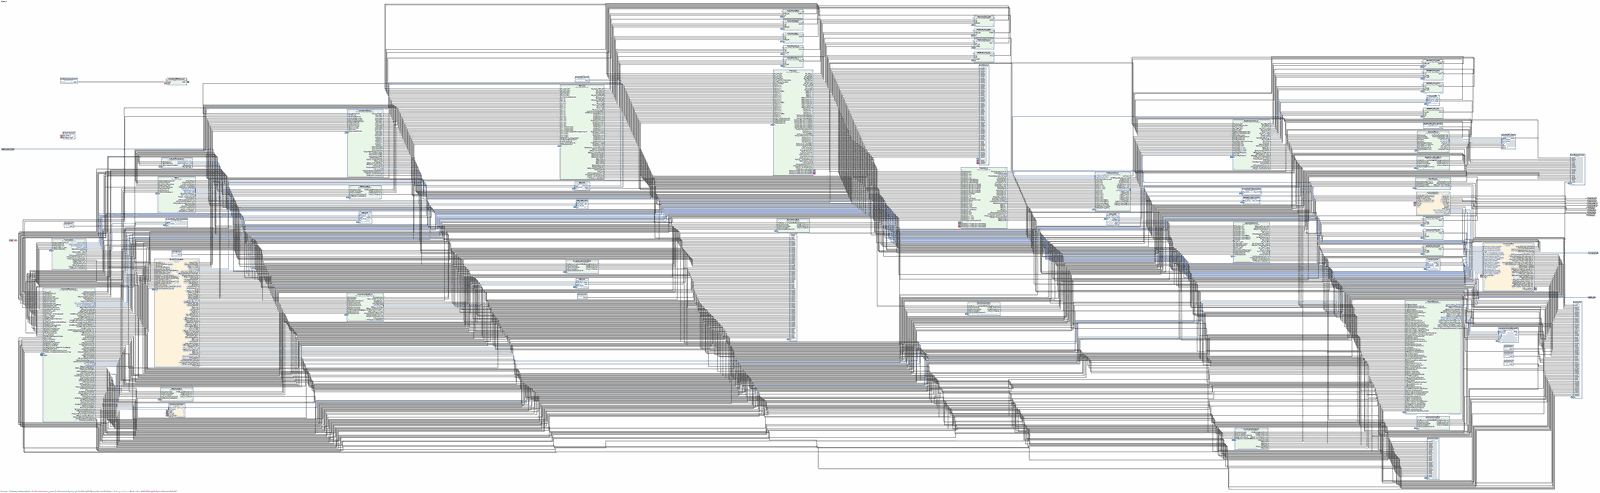
[diagram p0: block diagram of the top level, whole]
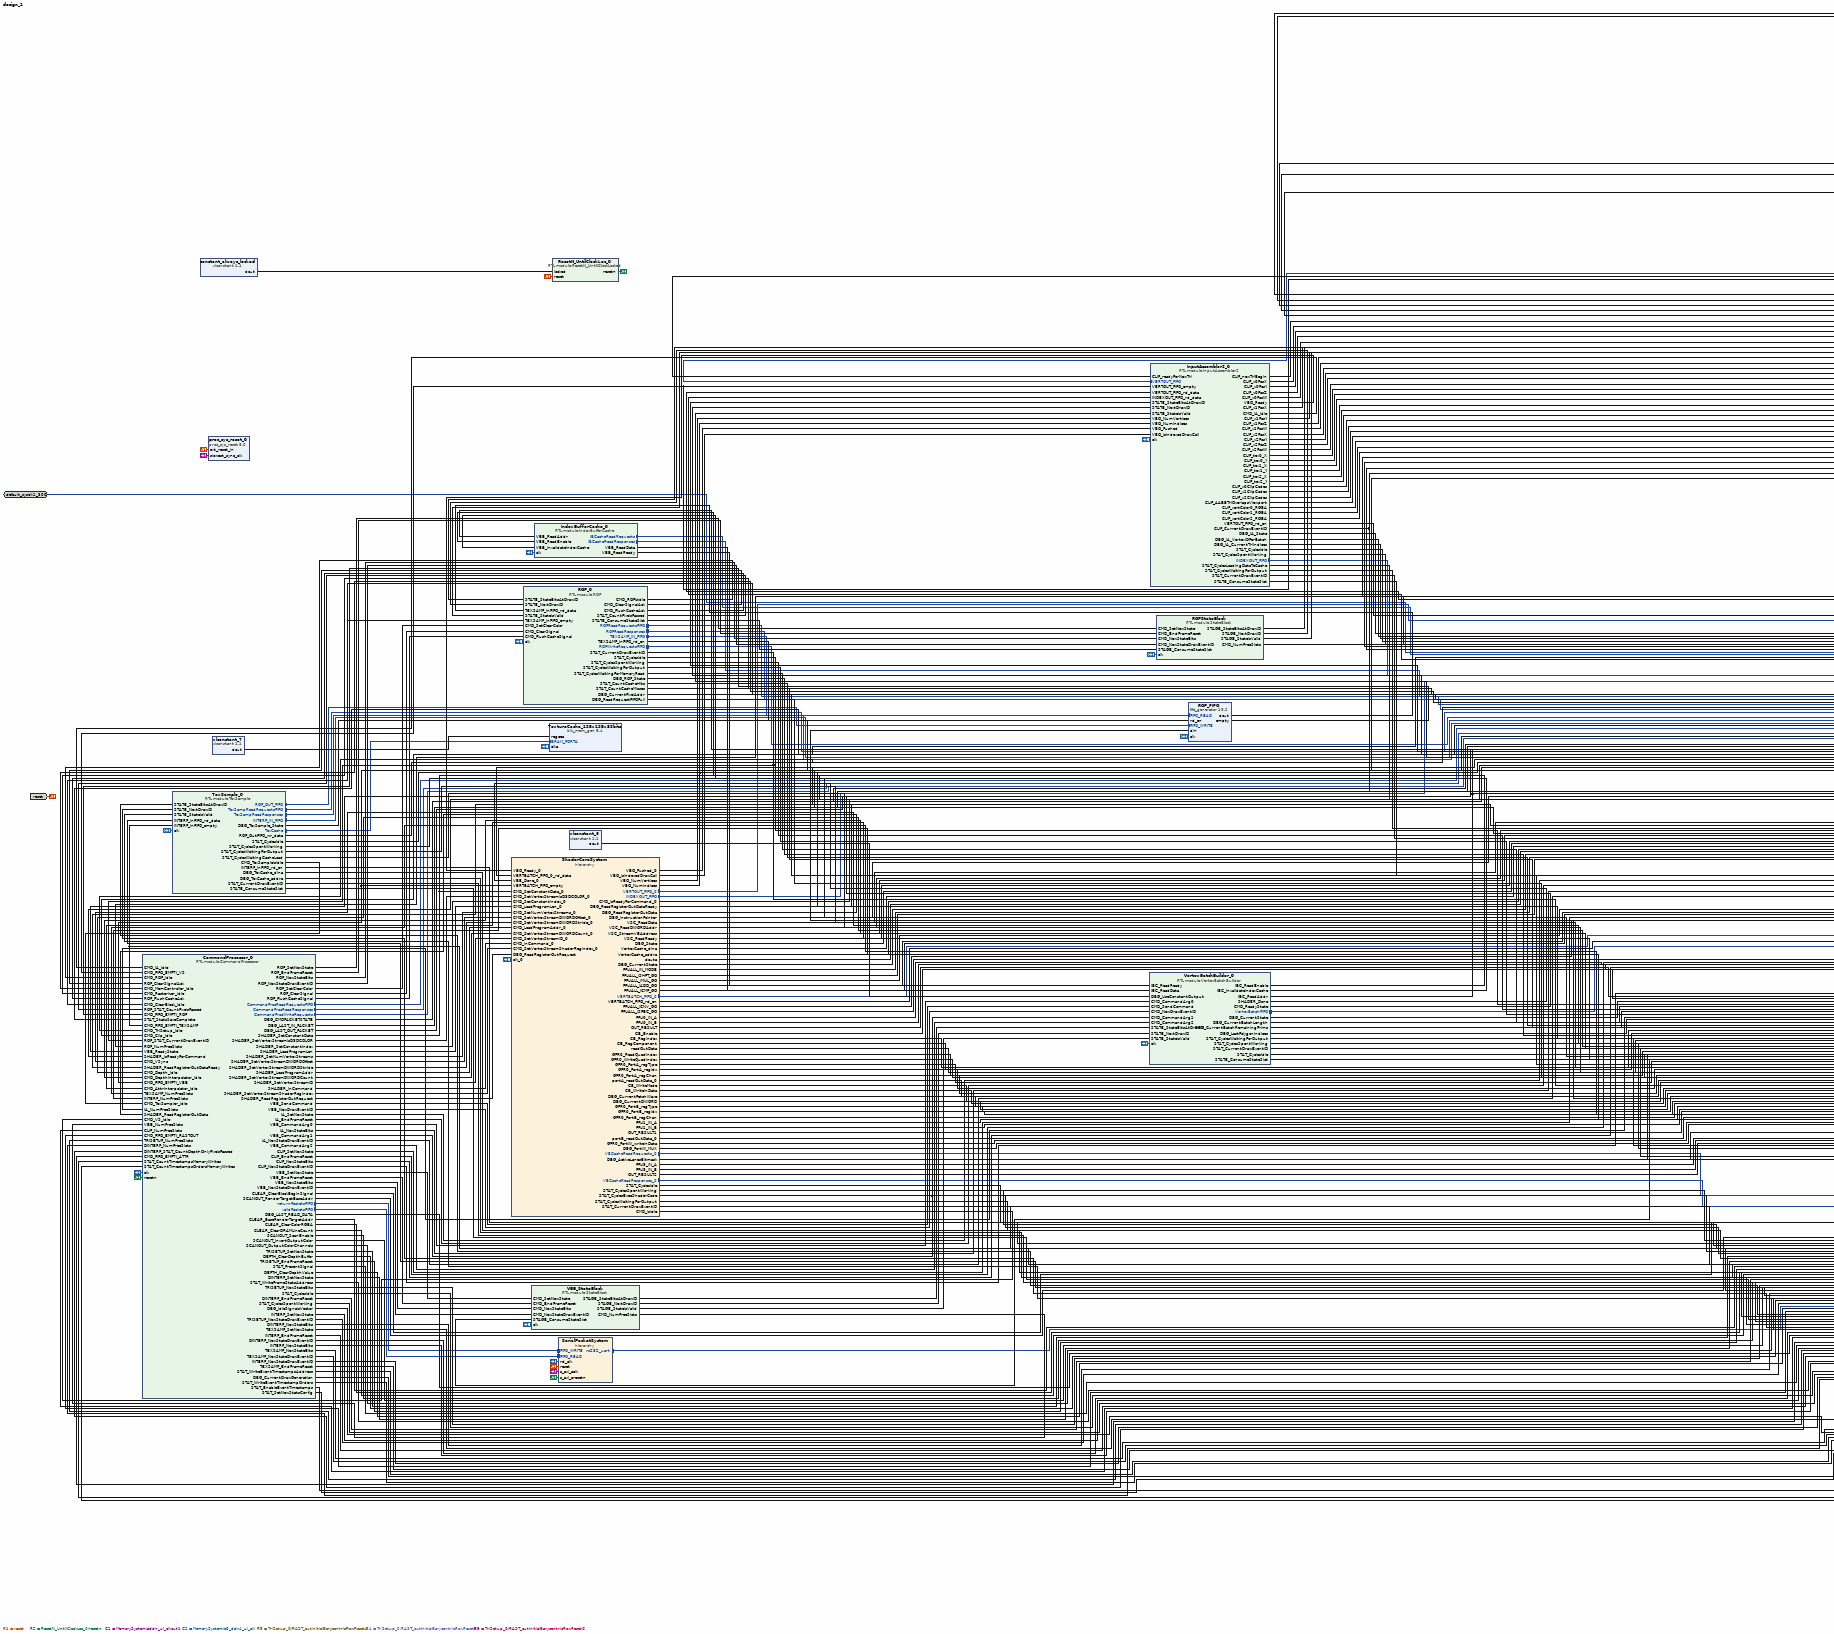
[diagram p1: block diagram of the top level, left part]
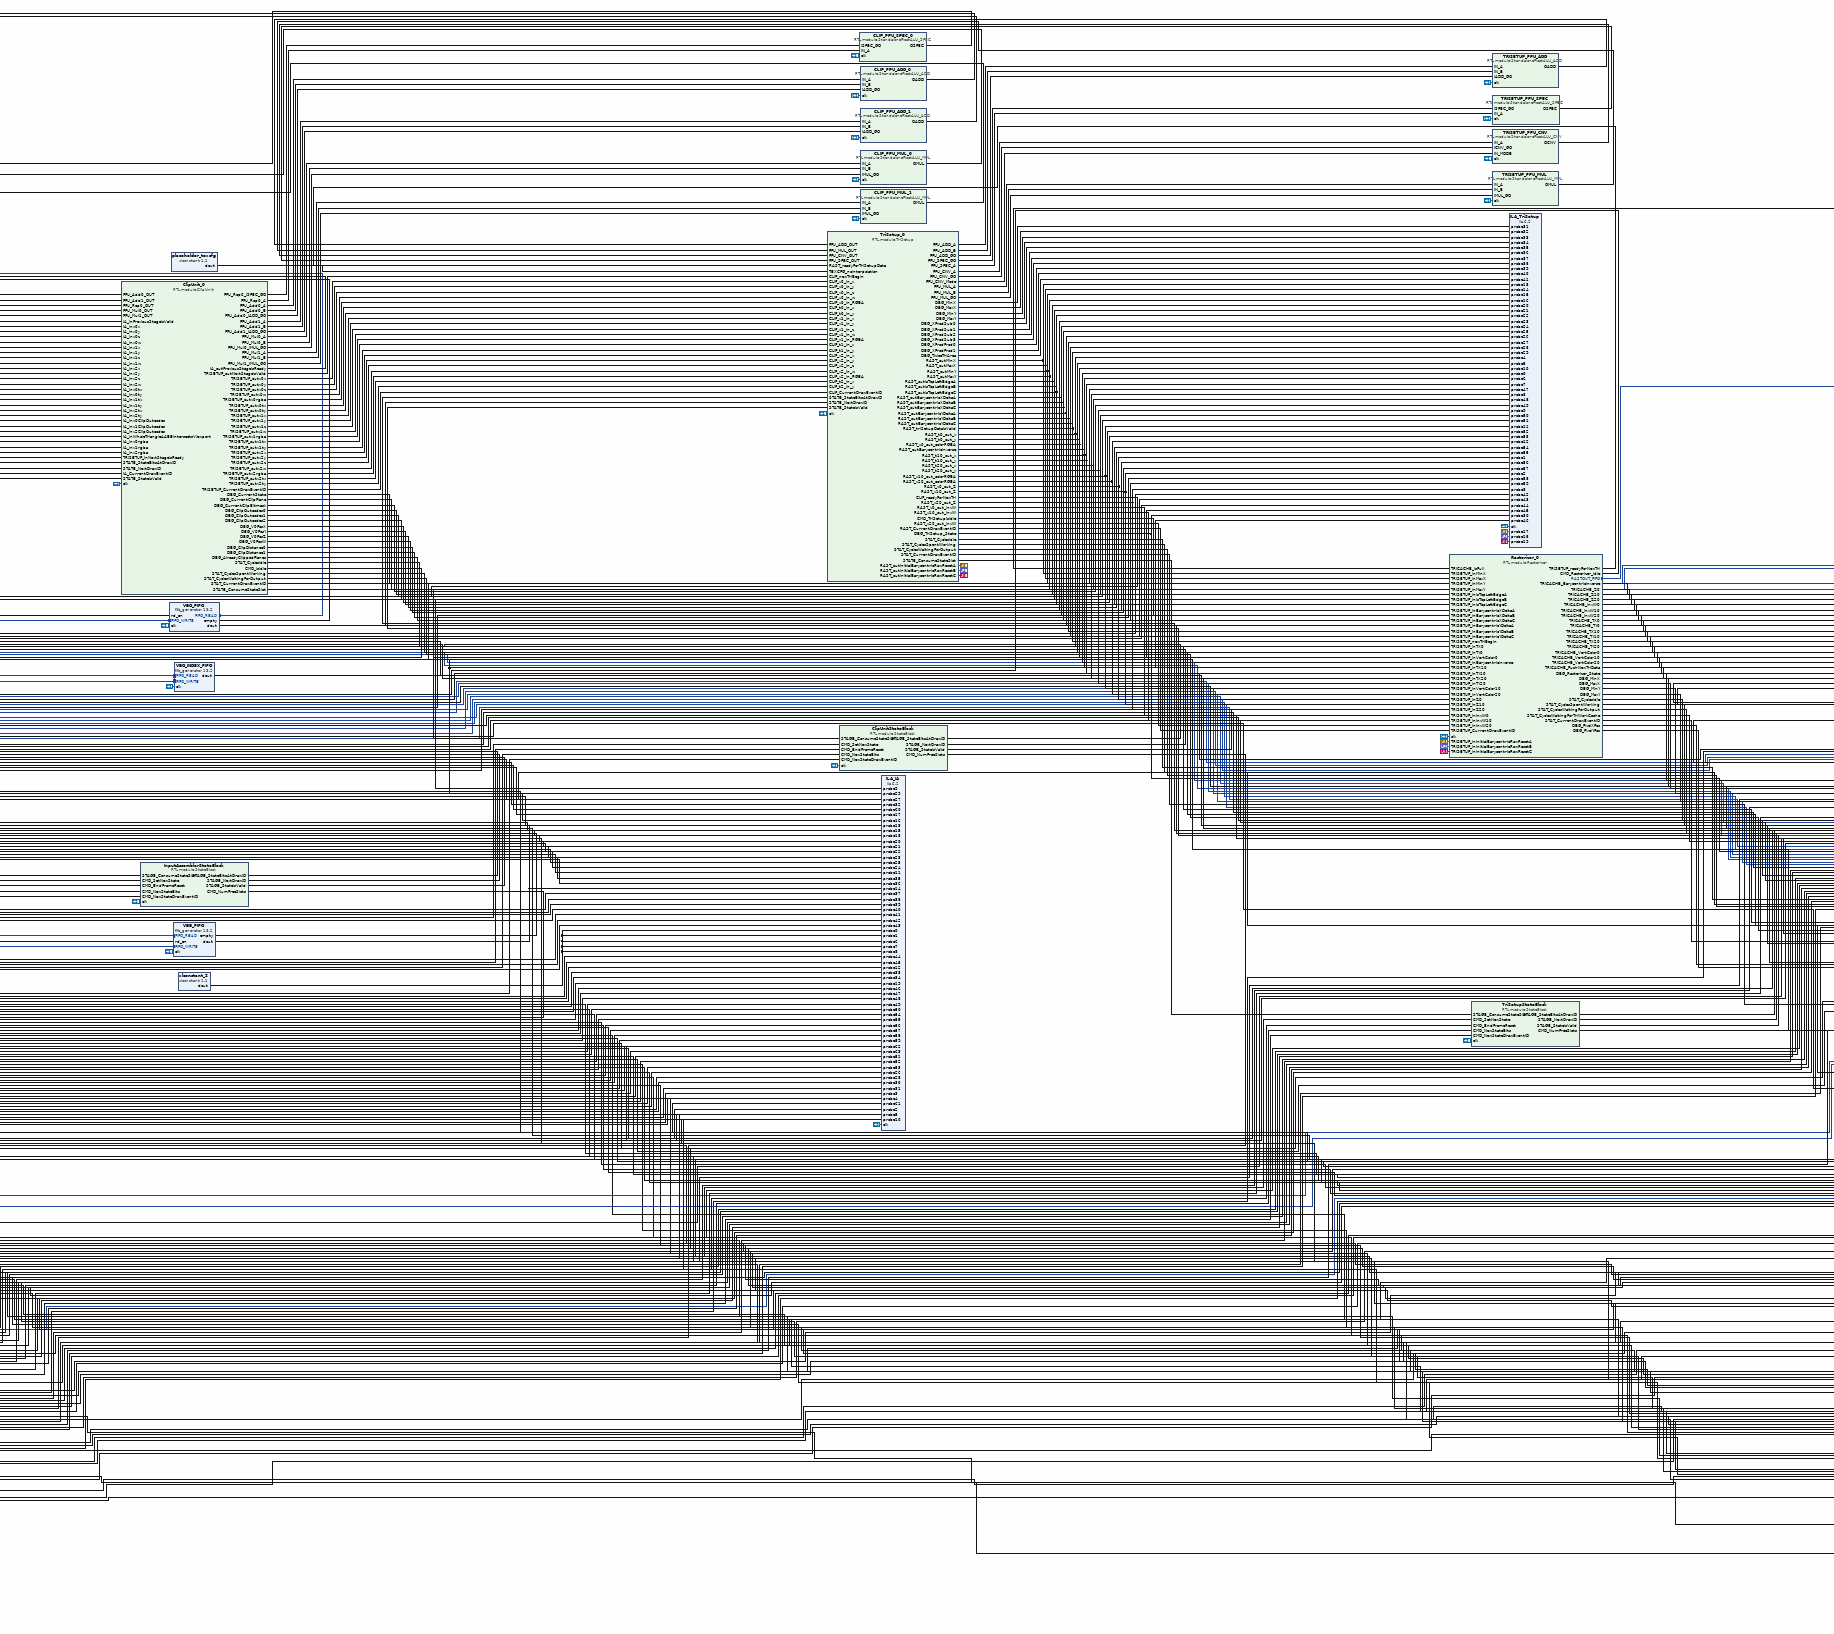
[diagram p2: block diagram of the top level, centre part]
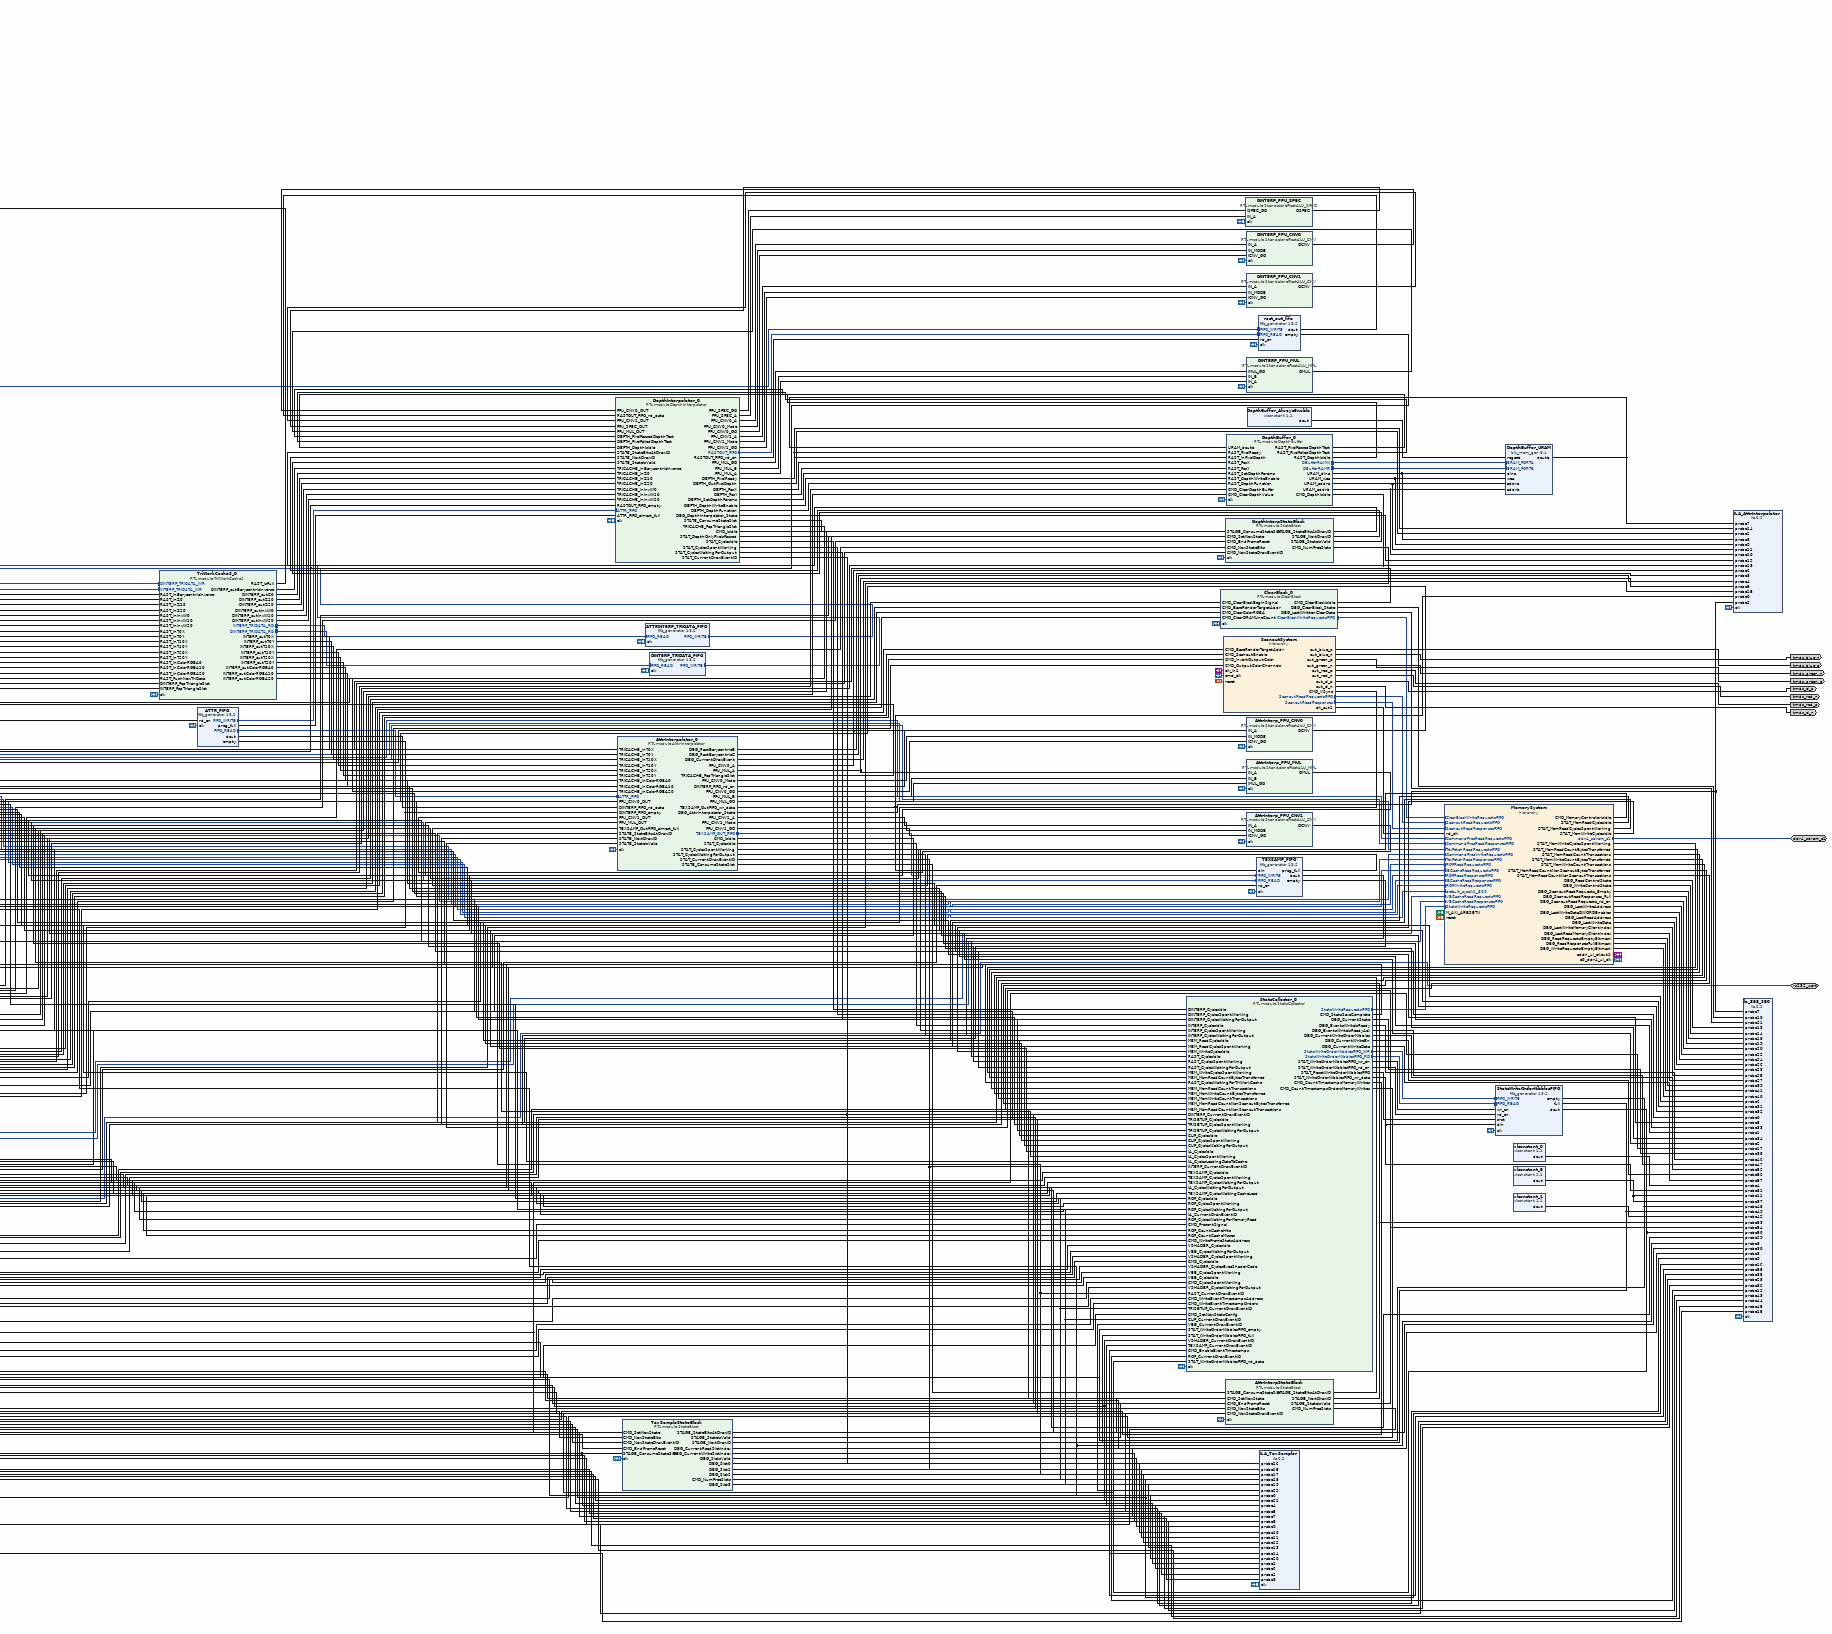
[diagram p3: block diagram of the top level, right part]
# Vivado block design design_1, xcku5p-ffvb676-2-e, Vivado 2018.1_AR73068
create_bd_design design_1

create_bd_intf_port -mode Master -vlnv xilinx.com:interface:uart_rtl:1.0 rs232_uart
create_bd_intf_port -mode Slave -vlnv xilinx.com:interface:diff_clock_rtl:1.0 default_sysclk1_300
set_property -dict {CONFIG.FREQ_HZ 300000000} [get_bd_intf_ports default_sysclk1_300]
create_bd_intf_port -mode Master -vlnv xilinx.com:interface:ddr4_rtl:1.0 ddr4_sdram_c1
create_bd_port -dir I -type rst reset
set_property -dict {CONFIG.POLARITY ACTIVE_HIGH} [get_bd_ports reset]
create_bd_port -dir O tmds_blue_p
create_bd_port -dir O tmds_blue_n
create_bd_port -dir O tmds_green_p
create_bd_port -dir O tmds_green_n
create_bd_port -dir O tmds_red_p
create_bd_port -dir O tmds_red_n
create_bd_port -dir O tmds_cl_p
create_bd_port -dir O tmds_cl_n

create_bd_cell -type ip -vlnv xilinx.com:ip:ila:6.2 ila_333_250
set_property -dict [list \
  CONFIG.C_PROBE57_TYPE 1 \
  CONFIG.C_PROBE34_TYPE 0 \
  CONFIG.C_PROBE33_TYPE 0 \
  CONFIG.C_PROBE32_TYPE 0 \
  CONFIG.C_PROBE31_TYPE 0 \
  CONFIG.C_PROBE30_TYPE 0 \
  CONFIG.C_PROBE29_TYPE 0 \
  CONFIG.C_PROBE28_TYPE 0 \
  CONFIG.C_PROBE27_TYPE 0 \
  CONFIG.C_PROBE26_TYPE 0 \
  CONFIG.C_PROBE25_TYPE 0 \
  CONFIG.C_PROBE24_TYPE 0 \
  CONFIG.C_PROBE23_TYPE 0 \
  CONFIG.C_PROBE22_TYPE 0 \
  CONFIG.C_PROBE21_TYPE 0 \
  CONFIG.C_PROBE20_TYPE 0 \
  CONFIG.C_PROBE19_TYPE 0 \
  CONFIG.C_PROBE18_TYPE 0 \
  CONFIG.C_PROBE17_TYPE 0 \
  CONFIG.C_PROBE16_TYPE 0 \
  CONFIG.C_PROBE15_TYPE 0 \
  CONFIG.C_PROBE14_TYPE 0 \
  CONFIG.C_PROBE13_TYPE 0 \
  CONFIG.C_PROBE12_TYPE 0 \
  CONFIG.C_PROBE11_TYPE 0 \
  CONFIG.C_PROBE10_TYPE 0 \
  CONFIG.C_PROBE9_TYPE 0 \
  CONFIG.C_PROBE8_TYPE 0 \
  CONFIG.C_PROBE7_TYPE 0 \
  CONFIG.C_PROBE6_TYPE 0 \
  CONFIG.C_PROBE5_TYPE 0 \
  CONFIG.C_PROBE4_TYPE 0 \
  CONFIG.C_PROBE3_TYPE 0 \
  CONFIG.C_PROBE2_TYPE 0 \
  CONFIG.C_PROBE1_TYPE 0 \
  CONFIG.C_PROBE0_TYPE 0 \
  CONFIG.C_PROBE57_WIDTH 294 \
  CONFIG.C_PROBE54_WIDTH 16 \
  CONFIG.C_PROBE53_WIDTH 16 \
  CONFIG.C_PROBE52_WIDTH 16 \
  CONFIG.C_PROBE51_WIDTH 16 \
  CONFIG.C_PROBE50_WIDTH 16 \
  CONFIG.C_PROBE47_WIDTH 10 \
  CONFIG.C_PROBE46_WIDTH 10 \
  CONFIG.C_PROBE45_WIDTH 16 \
  CONFIG.C_PROBE44_WIDTH 20 \
  CONFIG.C_PROBE43_WIDTH 24 \
  CONFIG.C_PROBE42_WIDTH 3 \
  CONFIG.C_PROBE41_WIDTH 8 \
  CONFIG.C_PROBE40_WIDTH 6 \
  CONFIG.C_PROBE39_WIDTH 8 \
  CONFIG.C_PROBE38_WIDTH 5 \
  CONFIG.C_PROBE37_WIDTH 1 \
  CONFIG.C_PROBE35_WIDTH 30 \
  CONFIG.C_PROBE34_WIDTH 16 \
  CONFIG.C_PROBE33_WIDTH 16 \
  CONFIG.C_PROBE32_WIDTH 16 \
  CONFIG.C_PROBE31_WIDTH 16 \
  CONFIG.C_PROBE30_WIDTH 16 \
  CONFIG.C_PROBE29_WIDTH 16 \
  CONFIG.C_PROBE28_WIDTH 13 \
  CONFIG.C_PROBE27_WIDTH 4 \
  CONFIG.C_PROBE26_WIDTH 30 \
  CONFIG.C_PROBE25_WIDTH 4 \
  CONFIG.C_PROBE24_WIDTH 8 \
  CONFIG.C_PROBE23_WIDTH 256 \
  CONFIG.C_PROBE22_WIDTH 30 \
  CONFIG.C_PROBE21_WIDTH 294 \
  CONFIG.C_PROBE16_WIDTH 3 \
  CONFIG.C_PROBE15_WIDTH 16 \
  CONFIG.C_PROBE14_WIDTH 4 \
  CONFIG.C_PROBE13_WIDTH 4 \
  CONFIG.C_PROBE12_WIDTH 16 \
  CONFIG.C_PROBE11_WIDTH 1 \
  CONFIG.C_PROBE10_WIDTH 4 \
  CONFIG.C_PROBE9_WIDTH 5 \
  CONFIG.C_PROBE8_WIDTH 6 \
  CONFIG.C_PROBE7_WIDTH 3 \
  CONFIG.C_PROBE6_WIDTH 4 \
  CONFIG.C_PROBE5_WIDTH 8 \
  CONFIG.C_PROBE4_WIDTH 6 \
  CONFIG.C_PROBE3_WIDTH 32 \
  CONFIG.C_PROBE2_WIDTH 88 \
  CONFIG.C_PROBE1_WIDTH 88 \
  CONFIG.C_PROBE0_WIDTH 8 \
  CONFIG.C_NUM_OF_PROBES 58 \
  CONFIG.C_ENABLE_ILA_AXI_MON false \
  CONFIG.C_MONITOR_TYPE Native \
] [get_bd_cells ila_333_250]
create_bd_cell -type ip -vlnv xilinx.com:ip:xlconstant:1.1 constant_always_locked
create_bd_cell -type ip -vlnv xilinx.com:ip:proc_sys_reset:5.0 proc_sys_reset_0
set_property -dict {CONFIG.RESET_BOARD_INTERFACE reset} [get_bd_cells proc_sys_reset_0]
create_bd_cell -type hier MemorySystem
create_bd_cell -type hier SerialPacketSystem
create_bd_cell -type ip -vlnv xilinx.com:ip:xlconstant:1.1 placeholder_texcfg
set_property -dict {CONFIG.CONST_VAL 0} [get_bd_cells placeholder_texcfg]
create_bd_cell -type ip -vlnv xilinx.com:ip:fifo_generator:13.2 rast_out_fifo
set_property -dict [list \
  CONFIG.Fifo_Implementation Common_Clock_Block_RAM \
  CONFIG.Performance_Options First_Word_Fall_Through \
  CONFIG.asymmetric_port_width false \
  CONFIG.Input_Data_Width 96 \
  CONFIG.Input_Depth 512 \
  CONFIG.Use_Embedded_Registers false \
  CONFIG.Reset_Pin false \
  CONFIG.Almost_Full_Flag true \
  CONFIG.Almost_Empty_Flag false \
  CONFIG.Valid_Flag false \
  CONFIG.Underflow_Flag false \
  CONFIG.Write_Acknowledge_Flag false \
  CONFIG.Overflow_Flag false \
  CONFIG.Data_Count false \
  CONFIG.Programmable_Full_Type No_Programmable_Full_Threshold \
  CONFIG.Programmable_Empty_Type No_Programmable_Empty_Threshold \
] [get_bd_cells rast_out_fifo]
create_bd_cell -type ip -vlnv xilinx.com:ip:blk_mem_gen:8.4 TextureCache_128x128x32bits
set_property -dict [list \
  CONFIG.Memory_Type Single_Port_RAM \
  CONFIG.PRIM_type_to_Implement URAM \
  CONFIG.Enable_32bit_Address false \
  CONFIG.Use_Byte_Write_Enable false \
  CONFIG.Write_Width_A 32 \
  CONFIG.Write_Depth_A 16384 \
  CONFIG.Operating_Mode_A NO_CHANGE \
  CONFIG.Register_PortA_Output_of_Memory_Primitives true \
  CONFIG.Use_RSTA_Pin false \
  CONFIG.Port_B_Clock 0 \
  CONFIG.Port_B_Write_Rate 0 \
  CONFIG.Port_B_Enable_Rate 0 \
  CONFIG.use_bram_block Stand_Alone \
] [get_bd_cells TextureCache_128x128x32bits]
create_bd_cell -type module -reference ResetN_UntilClockLocked ResetN_UntilClockLoc_0
create_bd_cell -type hier ScanoutSystem
create_bd_cell -type ip -vlnv xilinx.com:ip:ila:6.2 ILA_IA
set_property -dict [list \
  CONFIG.C_PROBE5_TYPE 0 \
  CONFIG.C_PROBE4_TYPE 0 \
  CONFIG.C_PROBE3_TYPE 0 \
  CONFIG.C_PROBE2_TYPE 0 \
  CONFIG.C_PROBE1_TYPE 0 \
  CONFIG.C_PROBE0_TYPE 0 \
  CONFIG.C_PROBE63_WIDTH 3 \
  CONFIG.C_PROBE62_WIDTH 4 \
  CONFIG.C_PROBE61_WIDTH 17 \
  CONFIG.C_PROBE60_WIDTH 128 \
  CONFIG.C_PROBE59_WIDTH 32 \
  CONFIG.C_PROBE57_WIDTH 128 \
  CONFIG.C_PROBE56_WIDTH 2 \
  CONFIG.C_PROBE55_WIDTH 3 \
  CONFIG.C_PROBE54_WIDTH 2 \
  CONFIG.C_PROBE53_WIDTH 2 \
  CONFIG.C_PROBE52_WIDTH 3 \
  CONFIG.C_PROBE51_WIDTH 2 \
  CONFIG.C_PROBE50_WIDTH 2 \
  CONFIG.C_PROBE49_WIDTH 2 \
  CONFIG.C_PROBE48_WIDTH 32 \
  CONFIG.C_PROBE47_WIDTH 2 \
  CONFIG.C_PROBE46_WIDTH 8 \
  CONFIG.C_PROBE44_WIDTH 32 \
  CONFIG.C_PROBE43_WIDTH 32 \
  CONFIG.C_PROBE42_WIDTH 32 \
  CONFIG.C_PROBE35_WIDTH 3 \
  CONFIG.C_PROBE34_WIDTH 24 \
  CONFIG.C_PROBE33_WIDTH 5 \
  CONFIG.C_PROBE32_WIDTH 7 \
  CONFIG.C_PROBE31_WIDTH 128 \
  CONFIG.C_PROBE30_WIDTH 32 \
  CONFIG.C_PROBE29_WIDTH 272 \
  CONFIG.C_PROBE28_WIDTH 32 \
  CONFIG.C_PROBE27_WIDTH 5 \
  CONFIG.C_PROBE26_WIDTH 32 \
  CONFIG.C_PROBE25_WIDTH 10 \
  CONFIG.C_PROBE24_WIDTH 32 \
  CONFIG.C_PROBE23_WIDTH 32 \
  CONFIG.C_PROBE22_WIDTH 4 \
  CONFIG.C_PROBE20_WIDTH 30 \
  CONFIG.C_PROBE19_WIDTH 48 \
  CONFIG.C_PROBE18_WIDTH 22 \
  CONFIG.C_PROBE17_WIDTH 32 \
  CONFIG.C_PROBE16_WIDTH 30 \
  CONFIG.C_PROBE15_WIDTH 32 \
  CONFIG.C_PROBE14_WIDTH 544 \
  CONFIG.C_PROBE13_WIDTH 9 \
  CONFIG.C_PROBE12_WIDTH 4 \
  CONFIG.C_PROBE11_WIDTH 6 \
  CONFIG.C_PROBE10_WIDTH 32 \
  CONFIG.C_PROBE9_WIDTH 320 \
  CONFIG.C_PROBE8_WIDTH 16 \
  CONFIG.C_PROBE7_WIDTH 16 \
  CONFIG.C_PROBE6_WIDTH 16 \
  CONFIG.C_PROBE5_WIDTH 32 \
  CONFIG.C_PROBE4_WIDTH 2 \
  CONFIG.C_PROBE3_WIDTH 128 \
  CONFIG.C_PROBE2_WIDTH 32 \
  CONFIG.C_PROBE1_WIDTH 16 \
  CONFIG.C_PROBE0_WIDTH 16 \
  CONFIG.C_NUM_OF_PROBES 64 \
  CONFIG.ALL_PROBE_SAME_MU true \
  CONFIG.C_ENABLE_ILA_AXI_MON false \
  CONFIG.C_MONITOR_TYPE Native \
] [get_bd_cells ILA_IA]
create_bd_cell -type ip -vlnv xilinx.com:ip:ila:6.2 ILA_TriSetup
set_property -dict [list \
  CONFIG.C_PROBE59_WIDTH 11 \
  CONFIG.C_PROBE58_WIDTH 32 \
  CONFIG.C_PROBE57_WIDTH 32 \
  CONFIG.C_PROBE56_WIDTH 32 \
  CONFIG.C_PROBE55_WIDTH 32 \
  CONFIG.C_PROBE54_WIDTH 32 \
  CONFIG.C_PROBE53_WIDTH 32 \
  CONFIG.C_PROBE52_WIDTH 11 \
  CONFIG.C_PROBE51_WIDTH 11 \
  CONFIG.C_PROBE50_WIDTH 11 \
  CONFIG.C_PROBE49_WIDTH 3 \
  CONFIG.C_PROBE48_WIDTH 4 \
  CONFIG.C_PROBE47_WIDTH 8 \
  CONFIG.C_PROBE46_WIDTH 272 \
  CONFIG.C_PROBE45_WIDTH 320 \
  CONFIG.C_PROBE44_WIDTH 12 \
  CONFIG.C_PROBE43_WIDTH 4 \
  CONFIG.C_PROBE42_WIDTH 6 \
  CONFIG.C_PROBE41_WIDTH 32 \
  CONFIG.C_PROBE40_WIDTH 32 \
  CONFIG.C_PROBE39_WIDTH 32 \
  CONFIG.C_PROBE38_WIDTH 32 \
  CONFIG.C_PROBE37_WIDTH 32 \
  CONFIG.C_PROBE36_WIDTH 32 \
  CONFIG.C_PROBE35_WIDTH 32 \
  CONFIG.C_PROBE34_WIDTH 16 \
  CONFIG.C_PROBE33_WIDTH 16 \
  CONFIG.C_PROBE32_WIDTH 16 \
  CONFIG.C_PROBE31_WIDTH 16 \
  CONFIG.C_PROBE30_WIDTH 8 \
  CONFIG.C_PROBE28_WIDTH 16 \
  CONFIG.C_PROBE27_WIDTH 16 \
  CONFIG.C_PROBE26_WIDTH 16 \
  CONFIG.C_PROBE25_WIDTH 16 \
  CONFIG.C_PROBE24_WIDTH 16 \
  CONFIG.C_PROBE23_WIDTH 16 \
  CONFIG.C_PROBE19_WIDTH 32 \
  CONFIG.C_PROBE18_WIDTH 32 \
  CONFIG.C_PROBE17_WIDTH 32 \
  CONFIG.C_PROBE16_WIDTH 16 \
  CONFIG.C_PROBE15_WIDTH 16 \
  CONFIG.C_PROBE14_WIDTH 16 \
  CONFIG.C_PROBE13_WIDTH 16 \
  CONFIG.C_PROBE12_WIDTH 128 \
  CONFIG.C_PROBE11_WIDTH 128 \
  CONFIG.C_PROBE10_WIDTH 128 \
  CONFIG.C_PROBE9_WIDTH 32 \
  CONFIG.C_PROBE8_WIDTH 32 \
  CONFIG.C_PROBE7_WIDTH 32 \
  CONFIG.C_PROBE6_WIDTH 32 \
  CONFIG.C_PROBE5_WIDTH 32 \
  CONFIG.C_PROBE4_WIDTH 32 \
  CONFIG.C_PROBE3_WIDTH 32 \
  CONFIG.C_PROBE2_WIDTH 32 \
  CONFIG.C_PROBE1_WIDTH 32 \
  CONFIG.C_PROBE0_WIDTH 32 \
  CONFIG.C_NUM_OF_PROBES 60 \
  CONFIG.C_ENABLE_ILA_AXI_MON false \
  CONFIG.C_MONITOR_TYPE Native \
] [get_bd_cells ILA_TriSetup]
create_bd_cell -type ip -vlnv xilinx.com:ip:ila:6.2 ILA_AttrInterpolator
set_property -dict [list \
  CONFIG.C_PROBE29_WIDTH 1 \
  CONFIG.C_PROBE28_WIDTH 1 \
  CONFIG.C_PROBE27_WIDTH 1 \
  CONFIG.C_PROBE26_WIDTH 1 \
  CONFIG.C_PROBE25_WIDTH 1 \
  CONFIG.C_PROBE24_WIDTH 1 \
  CONFIG.C_PROBE23_WIDTH 1 \
  CONFIG.C_PROBE22_WIDTH 1 \
  CONFIG.C_PROBE21_WIDTH 1 \
  CONFIG.C_PROBE20_WIDTH 1 \
  CONFIG.C_PROBE19_WIDTH 1 \
  CONFIG.C_PROBE18_WIDTH 1 \
  CONFIG.C_PROBE17_WIDTH 1 \
  CONFIG.C_PROBE16_WIDTH 1 \
  CONFIG.C_PROBE15_WIDTH 16 \
  CONFIG.C_PROBE14_WIDTH 1 \
  CONFIG.C_PROBE13_WIDTH 1 \
  CONFIG.C_PROBE12_WIDTH 7 \
  CONFIG.C_PROBE11_WIDTH 18 \
  CONFIG.C_PROBE10_WIDTH 18 \
  CONFIG.C_PROBE9_WIDTH 8 \
  CONFIG.C_PROBE8_WIDTH 64 \
  CONFIG.C_PROBE7_WIDTH 64 \
  CONFIG.C_PROBE6_WIDTH 32 \
  CONFIG.C_PROBE5_WIDTH 32 \
  CONFIG.C_PROBE4_WIDTH 32 \
  CONFIG.C_PROBE3_WIDTH 32 \
  CONFIG.C_PROBE2_WIDTH 3 \
  CONFIG.C_PROBE1_WIDTH 24 \
  CONFIG.C_PROBE0_WIDTH 96 \
  CONFIG.C_NUM_OF_PROBES 16 \
  CONFIG.C_ENABLE_ILA_AXI_MON false \
  CONFIG.C_MONITOR_TYPE Native \
] [get_bd_cells ILA_AttrInterpolator]
create_bd_cell -type ip -vlnv xilinx.com:ip:ila:6.2 ILA_TexSampler
set_property -dict [list \
  CONFIG.C_PROBE22_WIDTH 16 \
  CONFIG.C_PROBE21_WIDTH 16 \
  CONFIG.C_PROBE20_WIDTH 16 \
  CONFIG.C_PROBE19_WIDTH 16 \
  CONFIG.C_PROBE18_WIDTH 16 \
  CONFIG.C_PROBE17_WIDTH 16 \
  CONFIG.C_PROBE16_WIDTH 16 \
  CONFIG.C_PROBE15_WIDTH 16 \
  CONFIG.C_PROBE14_WIDTH 16 \
  CONFIG.C_PROBE13_WIDTH 16 \
  CONFIG.C_PROBE12_WIDTH 16 \
  CONFIG.C_PROBE11_WIDTH 16 \
  CONFIG.C_PROBE10_WIDTH 16 \
  CONFIG.C_PROBE9_WIDTH 4 \
  CONFIG.C_PROBE8_WIDTH 2 \
  CONFIG.C_PROBE7_WIDTH 2 \
  CONFIG.C_PROBE6_WIDTH 1 \
  CONFIG.C_PROBE5_WIDTH 16 \
  CONFIG.C_PROBE4_WIDTH 16 \
  CONFIG.C_PROBE3_WIDTH 14 \
  CONFIG.C_PROBE2_WIDTH 32 \
  CONFIG.C_PROBE1_WIDTH 64 \
  CONFIG.C_PROBE0_WIDTH 6 \
  CONFIG.C_NUM_OF_PROBES 23 \
  CONFIG.C_ENABLE_ILA_AXI_MON false \
  CONFIG.C_MONITOR_TYPE Native \
] [get_bd_cells ILA_TexSampler]
create_bd_cell -type hier ShaderCoreSystem
create_bd_cell -type ip -vlnv xilinx.com:ip:fifo_generator:13.2 VBB_FIFO
set_property -dict [list \
  CONFIG.INTERFACE_TYPE Native \
  CONFIG.Performance_Options First_Word_Fall_Through \
  CONFIG.asymmetric_port_width false \
  CONFIG.Input_Data_Width 544 \
  CONFIG.Input_Depth 512 \
  CONFIG.Use_Embedded_Registers false \
  CONFIG.FIFO_Implementation_wach Common_Clock_Distributed_RAM \
  CONFIG.FIFO_Implementation_wdch Common_Clock_Block_RAM \
  CONFIG.FIFO_Implementation_wrch Common_Clock_Distributed_RAM \
  CONFIG.FIFO_Implementation_rach Common_Clock_Distributed_RAM \
  CONFIG.FIFO_Implementation_rdch Common_Clock_Block_RAM \
  CONFIG.FIFO_Implementation_axis Common_Clock_Block_RAM \
] [get_bd_cells VBB_FIFO]
create_bd_cell -type ip -vlnv xilinx.com:ip:fifo_generator:13.2 VBO_FIFO
set_property -dict [list \
  CONFIG.Performance_Options First_Word_Fall_Through \
  CONFIG.Input_Data_Width 320 \
  CONFIG.Input_Depth 512 \
  CONFIG.Use_Embedded_Registers false \
] [get_bd_cells VBO_FIFO]
create_bd_cell -type ip -vlnv xilinx.com:ip:xlconstant:1.1 xlconstant_0
set_property -dict {CONFIG.CONST_WIDTH 6 CONFIG.CONST_VAL 0} [get_bd_cells xlconstant_0]
create_bd_cell -type module -reference ClearBlock ClearBlock_0
create_bd_cell -type ip -vlnv xilinx.com:ip:fifo_generator:13.2 VBO_INDEX_FIFO
set_property -dict [list \
  CONFIG.Performance_Options First_Word_Fall_Through \
  CONFIG.Input_Data_Width 272 \
  CONFIG.Input_Depth 512 \
  CONFIG.Use_Embedded_Registers false \
] [get_bd_cells VBO_INDEX_FIFO]
create_bd_cell -type ip -vlnv xilinx.com:ip:xlconstant:1.1 xlconstant_2
set_property -dict {CONFIG.CONST_WIDTH 16 CONFIG.CONST_VAL 0} [get_bd_cells xlconstant_2]
create_bd_cell -type ip -vlnv xilinx.com:ip:blk_mem_gen:8.4 DepthBuffer_URAM
set_property -dict [list \
  CONFIG.Memory_Type Simple_Dual_Port_RAM \
  CONFIG.PRIM_type_to_Implement URAM \
  CONFIG.Enable_32bit_Address false \
  CONFIG.Use_Byte_Write_Enable true \
  CONFIG.Byte_Size 8 \
  CONFIG.Write_Width_A 64 \
  CONFIG.Write_Depth_A 153600 \
  CONFIG.Operating_Mode_A WRITE_FIRST \
  CONFIG.Register_PortB_Output_of_Memory_Primitives true \
  CONFIG.Register_PortB_Output_of_Memory_Core true \
  CONFIG.Pipeline_Stages 1 \
  CONFIG.Port_B_Clock 100 \
  CONFIG.Port_B_Enable_Rate 100 \
  CONFIG.use_bram_block Stand_Alone \
] [get_bd_cells DepthBuffer_URAM]
create_bd_cell -type ip -vlnv xilinx.com:ip:xlconstant:1.1 DepthBuffer_AlwaysEnable
create_bd_cell -type ip -vlnv xilinx.com:ip:xlconstant:1.1 xlconstant_7
create_bd_cell -type ip -vlnv xilinx.com:ip:fifo_generator:13.2 ROP_FIFO
set_property -dict [list \
  CONFIG.Fifo_Implementation Common_Clock_Block_RAM \
  CONFIG.INTERFACE_TYPE Native \
  CONFIG.Performance_Options First_Word_Fall_Through \
  CONFIG.Input_Data_Width 64 \
  CONFIG.Input_Depth 512 \
  CONFIG.Enable_ECC false \
  CONFIG.Use_Embedded_Registers false \
  CONFIG.Reset_Pin false \
  CONFIG.FIFO_Implementation_wach Common_Clock_Distributed_RAM \
  CONFIG.FIFO_Implementation_wdch Common_Clock_Block_RAM \
  CONFIG.FIFO_Implementation_wrch Common_Clock_Distributed_RAM \
  CONFIG.FIFO_Implementation_rach Common_Clock_Distributed_RAM \
  CONFIG.FIFO_Implementation_rdch Common_Clock_Block_RAM \
  CONFIG.FIFO_Implementation_axis Common_Clock_Block_RAM \
] [get_bd_cells ROP_FIFO]
create_bd_cell -type ip -vlnv xilinx.com:ip:fifo_generator:13.2 TEXSAMP_FIFO
set_property -dict [list \
  CONFIG.Fifo_Implementation Common_Clock_Block_RAM \
  CONFIG.Performance_Options First_Word_Fall_Through \
  CONFIG.Input_Data_Width 96 \
  CONFIG.Input_Depth 512 \
  CONFIG.Use_Embedded_Registers false \
  CONFIG.Reset_Pin false \
  CONFIG.Almost_Full_Flag false \
  CONFIG.Almost_Empty_Flag false \
  CONFIG.Programmable_Full_Type Single_Programmable_Full_Threshold_Constant \
  CONFIG.Full_Threshold_Assert_Value 462 \
] [get_bd_cells TEXSAMP_FIFO]
create_bd_cell -type ip -vlnv xilinx.com:ip:xlconstant:1.1 xlconstant_5
set_property -dict {CONFIG.CONST_VAL 0} [get_bd_cells xlconstant_5]
create_bd_cell -type ip -vlnv xilinx.com:ip:xlconstant:1.1 xlconstant_6
set_property -dict {CONFIG.CONST_VAL 0} [get_bd_cells xlconstant_6]
create_bd_cell -type module -reference StateBlock TexSampleStateBlock
set_property -dict {CONFIG.StateBitsCount 74} [get_bd_cells TexSampleStateBlock]
create_bd_cell -type module -reference StateBlock AttrInterpStateBlock
set_property -dict {CONFIG.StateBitsCount 7} [get_bd_cells AttrInterpStateBlock]
create_bd_cell -type module -reference StateBlock InputAssemblerStateBlock
set_property -dict {CONFIG.StateBitsCount 5} [get_bd_cells InputAssemblerStateBlock]
create_bd_cell -type module -reference IndexBufferCache IndexBufferCache_0
create_bd_cell -type module -reference StateBlock ClipUnitStateBlock
set_property -dict {CONFIG.StateBitsCount 11} [get_bd_cells ClipUnitStateBlock]
create_bd_cell -type module -reference StateBlock ROPStateBlock
set_property -dict {CONFIG.StateBitsCount 101} [get_bd_cells ROPStateBlock]
create_bd_cell -type module -reference StateBlock DepthInterpStateBlock
set_property -dict {CONFIG.StateBitsCount 40} [get_bd_cells DepthInterpStateBlock]
create_bd_cell -type module -reference StateBlock TriSetupStateBlock
set_property -dict {CONFIG.StateBitsCount 192} [get_bd_cells TriSetupStateBlock]
create_bd_cell -type module -reference StateBlock VBB_StateBlock
set_property -dict {CONFIG.StateBitsCount 35} [get_bd_cells VBB_StateBlock]
create_bd_cell -type ip -vlnv xilinx.com:ip:xlconstant:1.1 xlconstant_1
set_property -dict {CONFIG.CONST_WIDTH 3 CONFIG.CONST_VAL 0} [get_bd_cells xlconstant_1]
create_bd_cell -type ip -vlnv xilinx.com:ip:fifo_generator:13.2 ATTR_FIFO
set_property -dict [list \
  CONFIG.Performance_Options First_Word_Fall_Through \
  CONFIG.Input_Data_Width 128 \
  CONFIG.Input_Depth 512 \
  CONFIG.Use_Embedded_Registers false \
  CONFIG.Programmable_Full_Type Single_Programmable_Full_Threshold_Constant \
  CONFIG.Full_Threshold_Assert_Value 462 \
] [get_bd_cells ATTR_FIFO]
create_bd_cell -type ip -vlnv xilinx.com:ip:fifo_generator:13.2 StatsWriteOrderNibblesFIFO
set_property -dict [list \
  CONFIG.Performance_Options First_Word_Fall_Through \
  CONFIG.Input_Data_Width 16 \
  CONFIG.Input_Depth 8192 \
] [get_bd_cells StatsWriteOrderNibblesFIFO]
create_bd_cell -type module -reference StatsCollector StatsCollector_0
create_bd_cell -type ip -vlnv xilinx.com:ip:fifo_generator:13.2 DINTERP_TRIDATA_FIFO
set_property -dict [list \
  CONFIG.Performance_Options First_Word_Fall_Through \
  CONFIG.Input_Data_Width 224 \
  CONFIG.Input_Depth 512 \
  CONFIG.Use_Embedded_Registers false \
] [get_bd_cells DINTERP_TRIDATA_FIFO]
create_bd_cell -type ip -vlnv xilinx.com:ip:fifo_generator:13.2 ATTRINTERP_TRIDATA_FIFO
set_property -dict [list \
  CONFIG.Performance_Options First_Word_Fall_Through \
  CONFIG.Input_Data_Width 576 \
  CONFIG.Input_Depth 512 \
  CONFIG.Use_Embedded_Registers false \
] [get_bd_cells ATTRINTERP_TRIDATA_FIFO]
create_bd_cell -type module -reference TriWorkCache2 TriWorkCache2_0
create_bd_cell -type module -reference VertexBatchBuilder VertexBatchBuilder_0
create_bd_cell -type module -reference DepthBuffer DepthBuffer_0
create_bd_cell -type module -reference CommandProcessor CommandProcessor_0
create_bd_cell -type module -reference TriSetup TriSetup_0
create_bd_cell -type module -reference Rasterizer Rasterizer_0
create_bd_cell -type module -reference AttrInterpolator AttrInterpolator_0
create_bd_cell -type module -reference TexSample TexSample_0
create_bd_cell -type module -reference ROP ROP_0
create_bd_cell -type module -reference InputAssembler2 InputAssembler2_0
create_bd_cell -type module -reference DepthInterpolator DepthInterpolator_0
create_bd_cell -type module -reference ClipUnit ClipUnit_0
create_bd_cell -type module -reference StandaloneFloatALU_ADD TRISETUP_FPU_ADD
create_bd_cell -type module -reference StandaloneFloatALU_MUL TRISETUP_FPU_MUL
create_bd_cell -type module -reference StandaloneFloatALU_SPEC TRISETUP_FPU_SPEC
create_bd_cell -type module -reference StandaloneFloatALU_CNV TRISETUP_FPU_CNV
create_bd_cell -type module -reference StandaloneFloatALU_ADD CLIP_FPU_ADD_0
create_bd_cell -type module -reference StandaloneFloatALU_ADD CLIP_FPU_ADD_1
create_bd_cell -type module -reference StandaloneFloatALU_MUL CLIP_FPU_MUL_0
create_bd_cell -type module -reference StandaloneFloatALU_MUL CLIP_FPU_MUL_1
create_bd_cell -type module -reference StandaloneFloatALU_SPEC CLIP_FPU_SPEC_0
create_bd_cell -type module -reference StandaloneFloatALU_MUL AttrInterp_FPU_MUL
create_bd_cell -type module -reference StandaloneFloatALU_CNV AttrInterp_FPU_CNV0
create_bd_cell -type module -reference StandaloneFloatALU_MUL DINTERP_FPU_MUL
create_bd_cell -type module -reference StandaloneFloatALU_CNV DINTERP_FPU_CNV0
create_bd_cell -type module -reference StandaloneFloatALU_SPEC DINTERP_FPU_SPEC
create_bd_cell -type module -reference StandaloneFloatALU_CNV AttrInterp_FPU_CNV1
create_bd_cell -type module -reference StandaloneFloatALU_CNV DINTERP_FPU_CNV1

# ---- hierarchy /MemorySystem ----
current_bd_instance /MemorySystem
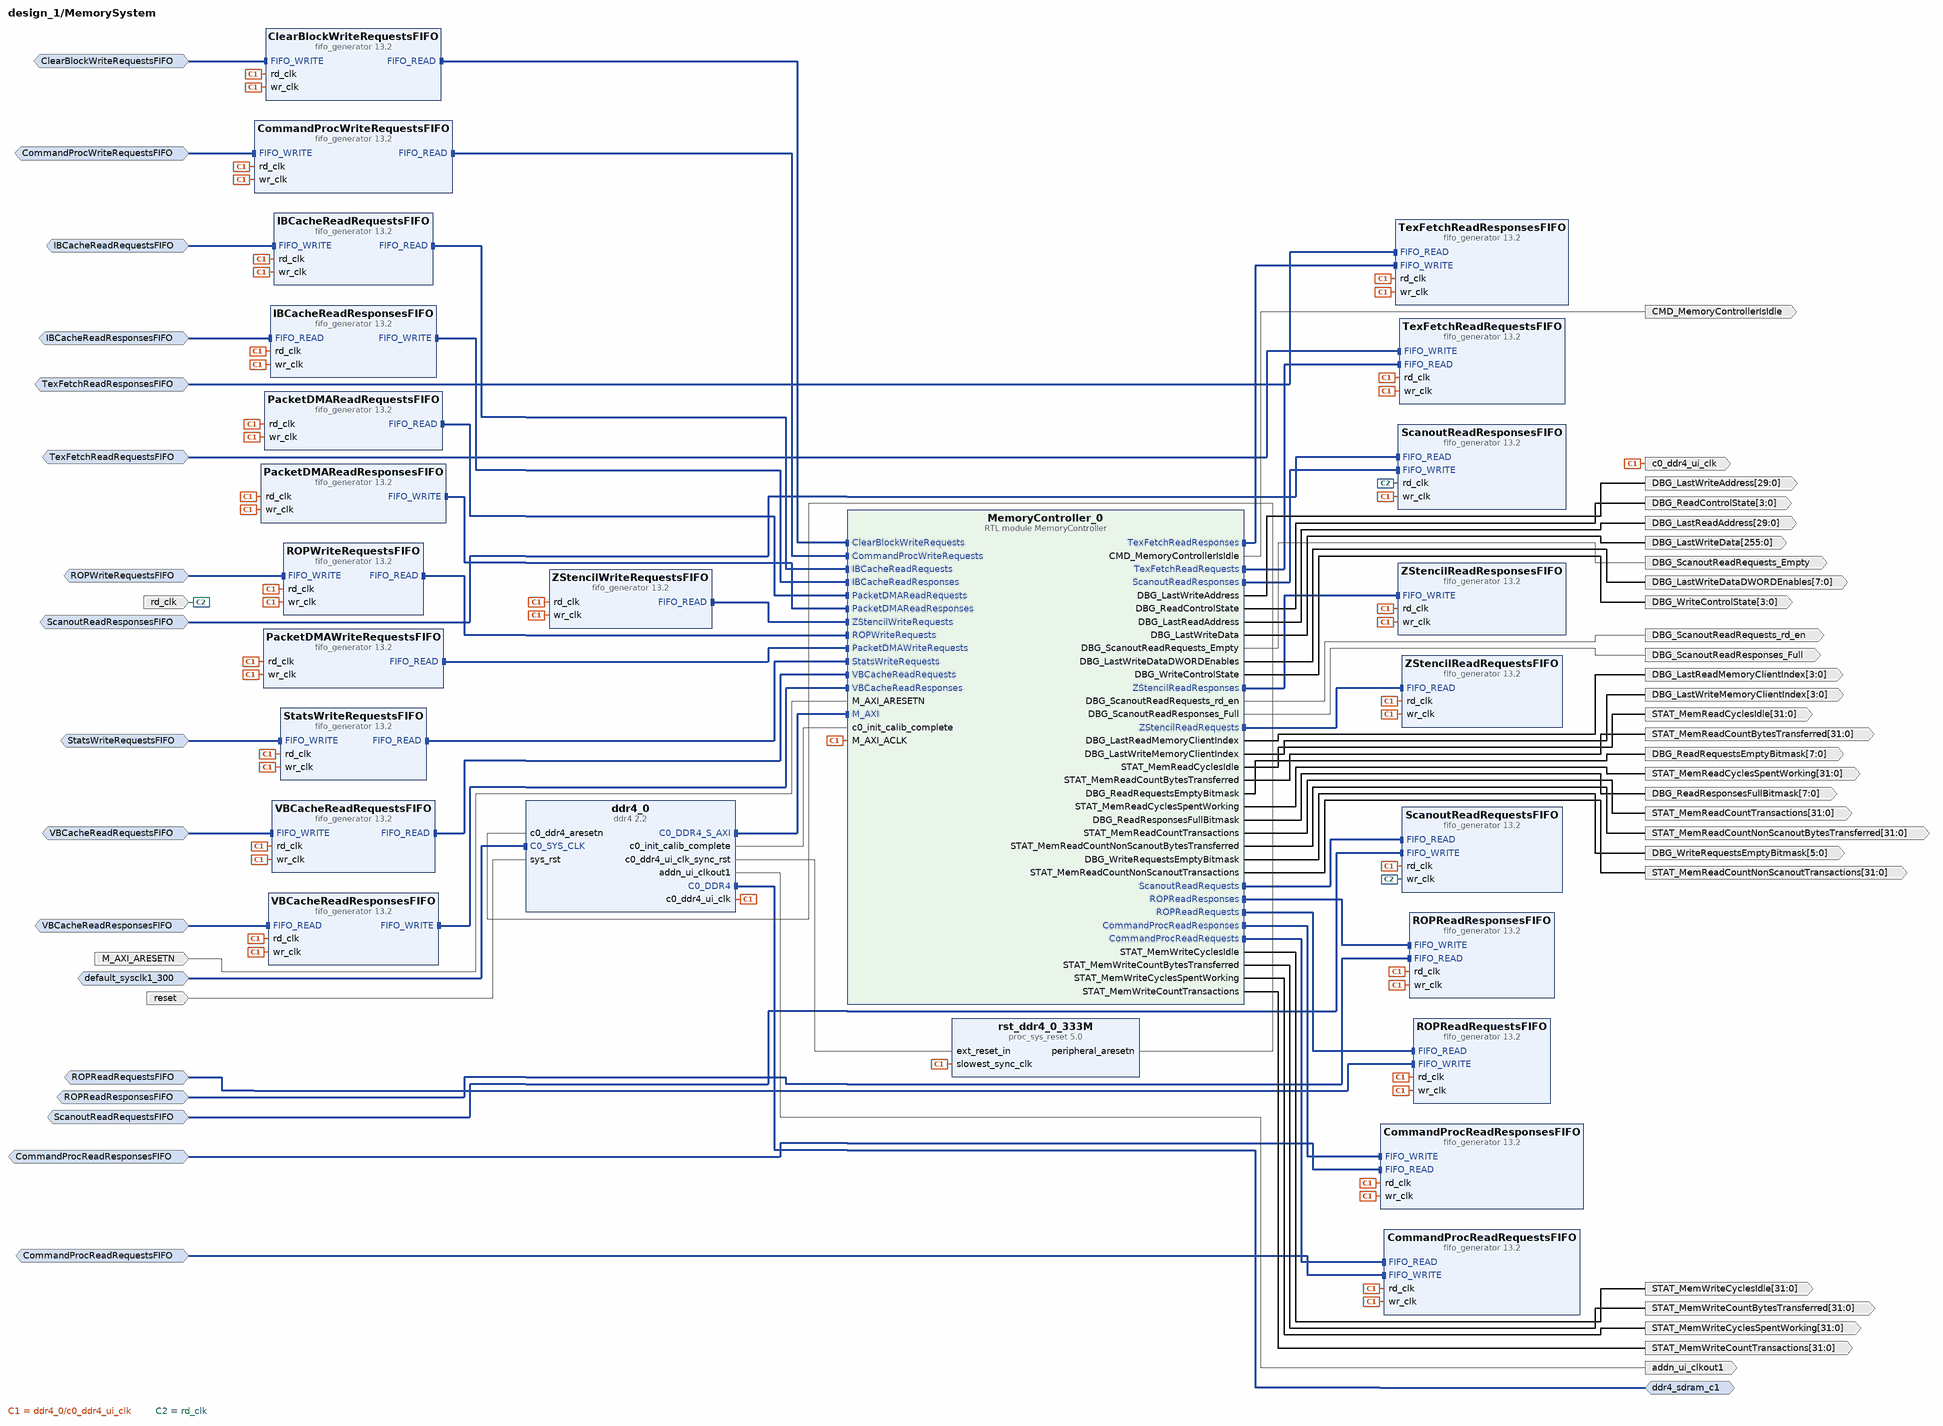
[diagram p4: block diagram inside /MemorySystem]
create_bd_intf_pin -mode Slave -vlnv xilinx.com:interface:diff_clock_rtl:1.0 default_sysclk1_300
create_bd_intf_pin -mode Master -vlnv xilinx.com:interface:ddr4_rtl:1.0 ddr4_sdram_c1
create_bd_intf_pin -mode Slave -vlnv xilinx.com:interface:fifo_write_rtl:1.0 CommandProcReadRequestsFIFO
create_bd_intf_pin -mode Slave -vlnv xilinx.com:interface:fifo_read_rtl:1.0 CommandProcReadResponsesFIFO
create_bd_intf_pin -mode Slave -vlnv xilinx.com:interface:fifo_write_rtl:1.0 CommandProcWriteRequestsFIFO
create_bd_intf_pin -mode Slave -vlnv xilinx.com:interface:fifo_write_rtl:1.0 TexFetchReadRequestsFIFO
create_bd_intf_pin -mode Slave -vlnv xilinx.com:interface:fifo_read_rtl:1.0 TexFetchReadResponsesFIFO
create_bd_intf_pin -mode Slave -vlnv xilinx.com:interface:fifo_write_rtl:1.0 ROPReadRequestsFIFO
create_bd_intf_pin -mode Slave -vlnv xilinx.com:interface:fifo_read_rtl:1.0 ROPReadResponsesFIFO
create_bd_intf_pin -mode Slave -vlnv xilinx.com:interface:fifo_write_rtl:1.0 ROPWriteRequestsFIFO
create_bd_intf_pin -mode Slave -vlnv xilinx.com:interface:fifo_write_rtl:1.0 ScanoutReadRequestsFIFO
create_bd_intf_pin -mode Slave -vlnv xilinx.com:interface:fifo_read_rtl:1.0 ScanoutReadResponsesFIFO
create_bd_intf_pin -mode Slave -vlnv xilinx.com:interface:fifo_write_rtl:1.0 ClearBlockWriteRequestsFIFO
create_bd_intf_pin -mode Slave -vlnv xilinx.com:interface:fifo_write_rtl:1.0 VBCacheReadRequestsFIFO
create_bd_intf_pin -mode Slave -vlnv xilinx.com:interface:fifo_read_rtl:1.0 VBCacheReadResponsesFIFO
create_bd_intf_pin -mode Slave -vlnv xilinx.com:interface:fifo_write_rtl:1.0 IBCacheReadRequestsFIFO
create_bd_intf_pin -mode Slave -vlnv xilinx.com:interface:fifo_read_rtl:1.0 IBCacheReadResponsesFIFO
create_bd_intf_pin -mode Slave -vlnv xilinx.com:interface:fifo_write_rtl:1.0 StatsWriteRequestsFIFO
create_bd_pin -dir O -type clk c0_ddr4_ui_clk
create_bd_pin -dir I -type rst M_AXI_ARESETN
create_bd_pin -dir O -type clk addn_ui_clkout1
create_bd_pin -dir I -type rst reset
create_bd_pin -dir O CMD_MemoryControllerIsIdle
create_bd_pin -dir I -type clk rd_clk
create_bd_pin -dir O -from 3 -to 0 DBG_ReadControlState
create_bd_pin -dir O -from 3 -to 0 DBG_WriteControlState
create_bd_pin -dir O DBG_ScanoutReadRequests_Empty
create_bd_pin -dir O DBG_ScanoutReadResponses_Full
create_bd_pin -dir O DBG_ScanoutReadRequests_rd_en
create_bd_pin -dir O -from 29 -to 0 DBG_LastWriteAddress
create_bd_pin -dir O -from 255 -to 0 DBG_LastWriteData
create_bd_pin -dir O -from 7 -to 0 DBG_LastWriteDataDWORDEnables
create_bd_pin -dir O -from 29 -to 0 DBG_LastReadAddress
create_bd_pin -dir O -from 31 -to 0 STAT_MemReadCyclesIdle
create_bd_pin -dir O -from 31 -to 0 STAT_MemReadCyclesSpentWorking
create_bd_pin -dir O -from 31 -to 0 STAT_MemWriteCyclesIdle
create_bd_pin -dir O -from 31 -to 0 STAT_MemWriteCyclesSpentWorking
create_bd_pin -dir O -from 31 -to 0 STAT_MemReadCountBytesTransferred
create_bd_pin -dir O -from 31 -to 0 STAT_MemReadCountTransactions
create_bd_pin -dir O -from 31 -to 0 STAT_MemWriteCountBytesTransferred
create_bd_pin -dir O -from 31 -to 0 STAT_MemWriteCountTransactions
create_bd_pin -dir O -from 31 -to 0 STAT_MemReadCountNonScanoutBytesTransferred
create_bd_pin -dir O -from 31 -to 0 STAT_MemReadCountNonScanoutTransactions
create_bd_pin -dir O -from 3 -to 0 DBG_LastWriteMemoryClientIndex
create_bd_pin -dir O -from 3 -to 0 DBG_LastReadMemoryClientIndex
create_bd_pin -dir O -from 7 -to 0 DBG_ReadRequestsEmptyBitmask
create_bd_pin -dir O -from 7 -to 0 DBG_ReadResponsesFullBitmask
create_bd_pin -dir O -from 5 -to 0 DBG_WriteRequestsEmptyBitmask

create_bd_cell -type ip -vlnv xilinx.com:ip:fifo_generator:13.2 ROPReadResponsesFIFO
set_property -dict [list \
  CONFIG.Fifo_Implementation Independent_Clocks_Builtin_FIFO \
  CONFIG.Performance_Options First_Word_Fall_Through \
  CONFIG.Input_Data_Width 256 \
  CONFIG.Input_Depth 512 \
  CONFIG.Read_Clock_Frequency 333 \
  CONFIG.Write_Clock_Frequency 333 \
] [get_bd_cells ROPReadResponsesFIFO]
create_bd_cell -type ip -vlnv xilinx.com:ip:fifo_generator:13.2 ZStencilReadRequestsFIFO
set_property -dict [list \
  CONFIG.Fifo_Implementation Independent_Clocks_Builtin_FIFO \
  CONFIG.Performance_Options First_Word_Fall_Through \
  CONFIG.Input_Data_Width 30 \
  CONFIG.Input_Depth 512 \
  CONFIG.Read_Clock_Frequency 333 \
  CONFIG.Write_Clock_Frequency 333 \
] [get_bd_cells ZStencilReadRequestsFIFO]
create_bd_cell -type ip -vlnv xilinx.com:ip:fifo_generator:13.2 ROPWriteRequestsFIFO
set_property -dict [list \
  CONFIG.Fifo_Implementation Independent_Clocks_Builtin_FIFO \
  CONFIG.Performance_Options First_Word_Fall_Through \
  CONFIG.Input_Data_Width 294 \
  CONFIG.Input_Depth 512 \
  CONFIG.Read_Clock_Frequency 333 \
  CONFIG.Write_Clock_Frequency 333 \
] [get_bd_cells ROPWriteRequestsFIFO]
create_bd_cell -type ip -vlnv xilinx.com:ip:fifo_generator:13.2 VBCacheReadRequestsFIFO
set_property -dict [list \
  CONFIG.Fifo_Implementation Independent_Clocks_Builtin_FIFO \
  CONFIG.Performance_Options First_Word_Fall_Through \
  CONFIG.Input_Data_Width 30 \
  CONFIG.Input_Depth 512 \
  CONFIG.Read_Clock_Frequency 333 \
  CONFIG.Write_Clock_Frequency 333 \
] [get_bd_cells VBCacheReadRequestsFIFO]
create_bd_cell -type ip -vlnv xilinx.com:ip:fifo_generator:13.2 CommandProcReadRequestsFIFO
set_property -dict [list \
  CONFIG.Fifo_Implementation Independent_Clocks_Builtin_FIFO \
  CONFIG.Performance_Options First_Word_Fall_Through \
  CONFIG.Input_Data_Width 30 \
  CONFIG.Input_Depth 512 \
  CONFIG.Read_Clock_Frequency 333 \
  CONFIG.Write_Clock_Frequency 333 \
] [get_bd_cells CommandProcReadRequestsFIFO]
create_bd_cell -type ip -vlnv xilinx.com:ip:fifo_generator:13.2 ZStencilWriteRequestsFIFO
set_property -dict [list \
  CONFIG.Fifo_Implementation Independent_Clocks_Builtin_FIFO \
  CONFIG.Performance_Options First_Word_Fall_Through \
  CONFIG.Input_Data_Width 294 \
  CONFIG.Input_Depth 512 \
  CONFIG.Read_Clock_Frequency 333 \
  CONFIG.Write_Clock_Frequency 333 \
] [get_bd_cells ZStencilWriteRequestsFIFO]
create_bd_cell -type ip -vlnv xilinx.com:ip:fifo_generator:13.2 TexFetchReadRequestsFIFO
set_property -dict [list \
  CONFIG.Fifo_Implementation Independent_Clocks_Builtin_FIFO \
  CONFIG.Performance_Options First_Word_Fall_Through \
  CONFIG.Input_Data_Width 30 \
  CONFIG.Input_Depth 512 \
  CONFIG.Read_Clock_Frequency 333 \
  CONFIG.Write_Clock_Frequency 333 \
] [get_bd_cells TexFetchReadRequestsFIFO]
create_bd_cell -type ip -vlnv xilinx.com:ip:fifo_generator:13.2 ScanoutReadRequestsFIFO
set_property -dict [list \
  CONFIG.Fifo_Implementation Independent_Clocks_Builtin_FIFO \
  CONFIG.Performance_Options First_Word_Fall_Through \
  CONFIG.Input_Data_Width 30 \
  CONFIG.Input_Depth 512 \
  CONFIG.Read_Clock_Frequency 333 \
  CONFIG.Write_Clock_Frequency 252 \
] [get_bd_cells ScanoutReadRequestsFIFO]
create_bd_cell -type ip -vlnv xilinx.com:ip:fifo_generator:13.2 ZStencilReadResponsesFIFO
set_property -dict [list \
  CONFIG.Fifo_Implementation Independent_Clocks_Builtin_FIFO \
  CONFIG.Performance_Options First_Word_Fall_Through \
  CONFIG.Input_Data_Width 256 \
  CONFIG.Input_Depth 512 \
  CONFIG.Read_Clock_Frequency 333 \
  CONFIG.Write_Clock_Frequency 333 \
] [get_bd_cells ZStencilReadResponsesFIFO]
create_bd_cell -type ip -vlnv xilinx.com:ip:fifo_generator:13.2 CommandProcWriteRequestsFIFO
set_property -dict [list \
  CONFIG.Fifo_Implementation Independent_Clocks_Builtin_FIFO \
  CONFIG.Performance_Options First_Word_Fall_Through \
  CONFIG.Input_Data_Width 294 \
  CONFIG.Input_Depth 512 \
  CONFIG.Read_Clock_Frequency 333 \
  CONFIG.Write_Clock_Frequency 333 \
] [get_bd_cells CommandProcWriteRequestsFIFO]
create_bd_cell -type ip -vlnv xilinx.com:ip:fifo_generator:13.2 VBCacheReadResponsesFIFO
set_property -dict [list \
  CONFIG.Fifo_Implementation Independent_Clocks_Builtin_FIFO \
  CONFIG.Performance_Options First_Word_Fall_Through \
  CONFIG.Input_Data_Width 256 \
  CONFIG.Input_Depth 512 \
  CONFIG.Read_Clock_Frequency 333 \
  CONFIG.Write_Clock_Frequency 333 \
] [get_bd_cells VBCacheReadResponsesFIFO]
create_bd_cell -type ip -vlnv xilinx.com:ip:fifo_generator:13.2 ROPReadRequestsFIFO
set_property -dict [list \
  CONFIG.Fifo_Implementation Independent_Clocks_Builtin_FIFO \
  CONFIG.Performance_Options First_Word_Fall_Through \
  CONFIG.Input_Data_Width 30 \
  CONFIG.Input_Depth 512 \
  CONFIG.Read_Clock_Frequency 333 \
  CONFIG.Write_Clock_Frequency 333 \
] [get_bd_cells ROPReadRequestsFIFO]
create_bd_cell -type ip -vlnv xilinx.com:ip:fifo_generator:13.2 ClearBlockWriteRequestsFIFO
set_property -dict [list \
  CONFIG.Fifo_Implementation Independent_Clocks_Builtin_FIFO \
  CONFIG.Performance_Options First_Word_Fall_Through \
  CONFIG.Input_Data_Width 294 \
  CONFIG.Input_Depth 512 \
  CONFIG.Read_Clock_Frequency 333 \
  CONFIG.Write_Clock_Frequency 333 \
] [get_bd_cells ClearBlockWriteRequestsFIFO]
create_bd_cell -type ip -vlnv xilinx.com:ip:fifo_generator:13.2 CommandProcReadResponsesFIFO
set_property -dict [list \
  CONFIG.Fifo_Implementation Independent_Clocks_Builtin_FIFO \
  CONFIG.Performance_Options First_Word_Fall_Through \
  CONFIG.Input_Data_Width 256 \
  CONFIG.Input_Depth 512 \
  CONFIG.Read_Clock_Frequency 333 \
  CONFIG.Write_Clock_Frequency 333 \
] [get_bd_cells CommandProcReadResponsesFIFO]
create_bd_cell -type ip -vlnv xilinx.com:ip:fifo_generator:13.2 ScanoutReadResponsesFIFO
set_property -dict [list \
  CONFIG.Fifo_Implementation Independent_Clocks_Builtin_FIFO \
  CONFIG.Performance_Options First_Word_Fall_Through \
  CONFIG.Input_Data_Width 256 \
  CONFIG.Input_Depth 512 \
  CONFIG.Read_Clock_Frequency 252 \
  CONFIG.Write_Clock_Frequency 333 \
] [get_bd_cells ScanoutReadResponsesFIFO]
create_bd_cell -type ip -vlnv xilinx.com:ip:fifo_generator:13.2 TexFetchReadResponsesFIFO
set_property -dict [list \
  CONFIG.Fifo_Implementation Independent_Clocks_Builtin_FIFO \
  CONFIG.Performance_Options First_Word_Fall_Through \
  CONFIG.Input_Data_Width 256 \
  CONFIG.Input_Depth 512 \
  CONFIG.Read_Clock_Frequency 333 \
  CONFIG.Write_Clock_Frequency 333 \
] [get_bd_cells TexFetchReadResponsesFIFO]
create_bd_cell -type ip -vlnv xilinx.com:ip:proc_sys_reset:5.0 rst_ddr4_0_333M
create_bd_cell -type ip -vlnv xilinx.com:ip:fifo_generator:13.2 StatsWriteRequestsFIFO
set_property -dict [list \
  CONFIG.Fifo_Implementation Independent_Clocks_Builtin_FIFO \
  CONFIG.Performance_Options First_Word_Fall_Through \
  CONFIG.Input_Data_Width 294 \
  CONFIG.Input_Depth 512 \
  CONFIG.Use_Embedded_Registers true \
  CONFIG.Read_Clock_Frequency 333 \
  CONFIG.Write_Clock_Frequency 333 \
] [get_bd_cells StatsWriteRequestsFIFO]
create_bd_cell -type ip -vlnv xilinx.com:ip:fifo_generator:13.2 IBCacheReadRequestsFIFO
set_property -dict [list \
  CONFIG.Fifo_Implementation Independent_Clocks_Builtin_FIFO \
  CONFIG.Performance_Options First_Word_Fall_Through \
  CONFIG.Input_Data_Width 30 \
  CONFIG.Input_Depth 512 \
  CONFIG.Read_Clock_Frequency 333 \
  CONFIG.Write_Clock_Frequency 333 \
] [get_bd_cells IBCacheReadRequestsFIFO]
create_bd_cell -type ip -vlnv xilinx.com:ip:fifo_generator:13.2 IBCacheReadResponsesFIFO
set_property -dict [list \
  CONFIG.Fifo_Implementation Independent_Clocks_Builtin_FIFO \
  CONFIG.Performance_Options First_Word_Fall_Through \
  CONFIG.Input_Data_Width 256 \
  CONFIG.Input_Depth 512 \
  CONFIG.Read_Clock_Frequency 333 \
  CONFIG.Write_Clock_Frequency 333 \
] [get_bd_cells IBCacheReadResponsesFIFO]
create_bd_cell -type ip -vlnv xilinx.com:ip:fifo_generator:13.2 PacketDMAReadRequestsFIFO
set_property -dict [list \
  CONFIG.Fifo_Implementation Independent_Clocks_Builtin_FIFO \
  CONFIG.Performance_Options First_Word_Fall_Through \
  CONFIG.Input_Data_Width 30 \
  CONFIG.Input_Depth 512 \
  CONFIG.Read_Clock_Frequency 333 \
  CONFIG.Write_Clock_Frequency 333 \
] [get_bd_cells PacketDMAReadRequestsFIFO]
create_bd_cell -type ip -vlnv xilinx.com:ip:fifo_generator:13.2 PacketDMAReadResponsesFIFO
set_property -dict [list \
  CONFIG.Fifo_Implementation Independent_Clocks_Builtin_FIFO \
  CONFIG.Performance_Options First_Word_Fall_Through \
  CONFIG.Input_Data_Width 256 \
  CONFIG.Input_Depth 512 \
  CONFIG.Read_Clock_Frequency 333 \
  CONFIG.Write_Clock_Frequency 333 \
] [get_bd_cells PacketDMAReadResponsesFIFO]
create_bd_cell -type ip -vlnv xilinx.com:ip:ddr4:2.2 ddr4_0
set_property -dict [list \
  CONFIG.RESET_BOARD_INTERFACE reset \
  CONFIG.C0_CLOCK_BOARD_INTERFACE default_sysclk1_300 \
  CONFIG.C0_DDR4_BOARD_INTERFACE ddr4_sdram_c1 \
  CONFIG.C0.DDR4_AxiAddressWidth 30 \
  CONFIG.C0.DDR4_AxiIDWidth 4 \
  CONFIG.ADDN_UI_CLKOUT1_FREQ_HZ 250 \
  CONFIG.C0.BANK_GROUP_WIDTH 1 \
] [get_bd_cells ddr4_0]
create_bd_cell -type module -reference MemoryController MemoryController_0
create_bd_cell -type ip -vlnv xilinx.com:ip:fifo_generator:13.2 PacketDMAWriteRequestsFIFO
set_property -dict [list \
  CONFIG.Fifo_Implementation Independent_Clocks_Builtin_FIFO \
  CONFIG.Performance_Options First_Word_Fall_Through \
  CONFIG.Input_Data_Width 294 \
  CONFIG.Input_Depth 512 \
  CONFIG.Read_Clock_Frequency 333 \
  CONFIG.Write_Clock_Frequency 333 \
] [get_bd_cells PacketDMAWriteRequestsFIFO]

# ---- hierarchy /SerialPacketSystem ----
current_bd_instance /SerialPacketSystem
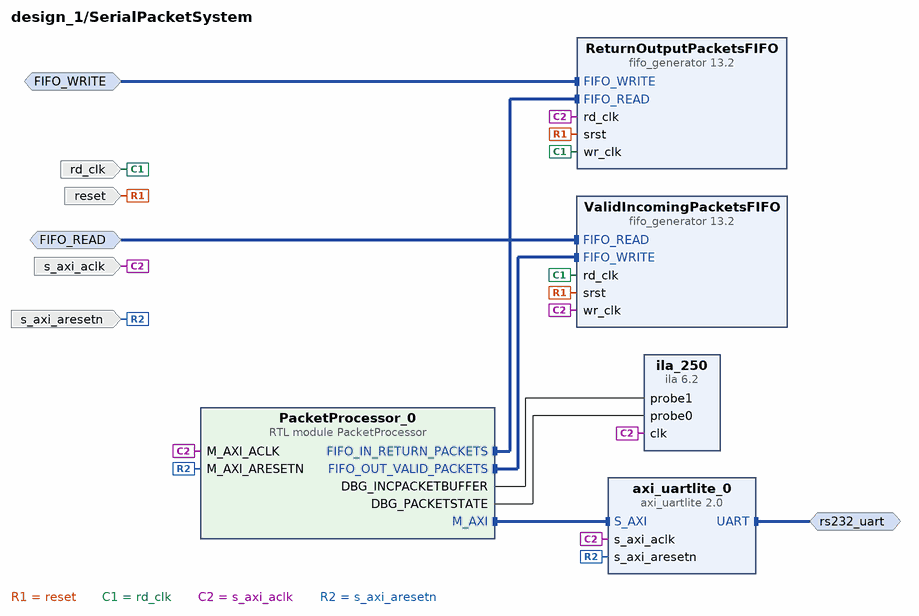
[diagram p5: block diagram inside /SerialPacketSystem]
create_bd_intf_pin -mode Slave -vlnv xilinx.com:interface:fifo_write_rtl:1.0 FIFO_WRITE
create_bd_intf_pin -mode Slave -vlnv xilinx.com:interface:fifo_read_rtl:1.0 FIFO_READ
create_bd_intf_pin -mode Master -vlnv xilinx.com:interface:uart_rtl:1.0 rs232_uart
create_bd_pin -dir I reset
create_bd_pin -dir I -type clk rd_clk
create_bd_pin -dir I -type clk s_axi_aclk
create_bd_pin -dir I -type rst s_axi_aresetn

create_bd_cell -type ip -vlnv xilinx.com:ip:fifo_generator:13.2 ReturnOutputPacketsFIFO
set_property -dict [list \
  CONFIG.Fifo_Implementation Independent_Clocks_Builtin_FIFO \
  CONFIG.Performance_Options First_Word_Fall_Through \
  CONFIG.Input_Data_Width 88 \
  CONFIG.Input_Depth 512 \
  CONFIG.Read_Clock_Frequency 250 \
  CONFIG.Write_Clock_Frequency 333 \
] [get_bd_cells ReturnOutputPacketsFIFO]
create_bd_cell -type ip -vlnv xilinx.com:ip:fifo_generator:13.2 ValidIncomingPacketsFIFO
set_property -dict [list \
  CONFIG.Fifo_Implementation Independent_Clocks_Builtin_FIFO \
  CONFIG.Performance_Options First_Word_Fall_Through \
  CONFIG.Input_Data_Width 88 \
  CONFIG.Input_Depth 512 \
  CONFIG.Use_Embedded_Registers true \
  CONFIG.Read_Clock_Frequency 333 \
  CONFIG.Write_Clock_Frequency 250 \
] [get_bd_cells ValidIncomingPacketsFIFO]
create_bd_cell -type ip -vlnv xilinx.com:ip:ila:6.2 ila_250
set_property -dict [list \
  CONFIG.C_PROBE1_TYPE 1 \
  CONFIG.C_PROBE0_TYPE 1 \
  CONFIG.C_PROBE1_WIDTH 88 \
  CONFIG.C_PROBE0_WIDTH 8 \
  CONFIG.C_NUM_OF_PROBES 2 \
  CONFIG.C_ENABLE_ILA_AXI_MON false \
  CONFIG.C_MONITOR_TYPE Native \
] [get_bd_cells ila_250]
create_bd_cell -type ip -vlnv xilinx.com:ip:axi_uartlite:2.0 axi_uartlite_0
set_property -dict [list \
  CONFIG.C_BAUDRATE 921600 \
  CONFIG.C_S_AXI_ACLK_FREQ_HZ 250000000 \
  CONFIG.C_S_AXI_ACLK_FREQ_HZ_d 250 \
  CONFIG.PARITY Odd \
  CONFIG.C_USE_PARITY 1 \
  CONFIG.C_ODD_PARITY 1 \
  CONFIG.USE_BOARD_FLOW true \
  CONFIG.UARTLITE_BOARD_INTERFACE rs232_uart \
] [get_bd_cells axi_uartlite_0]
create_bd_cell -type module -reference PacketProcessor PacketProcessor_0

# ---- hierarchy /ScanoutSystem ----
current_bd_instance /ScanoutSystem
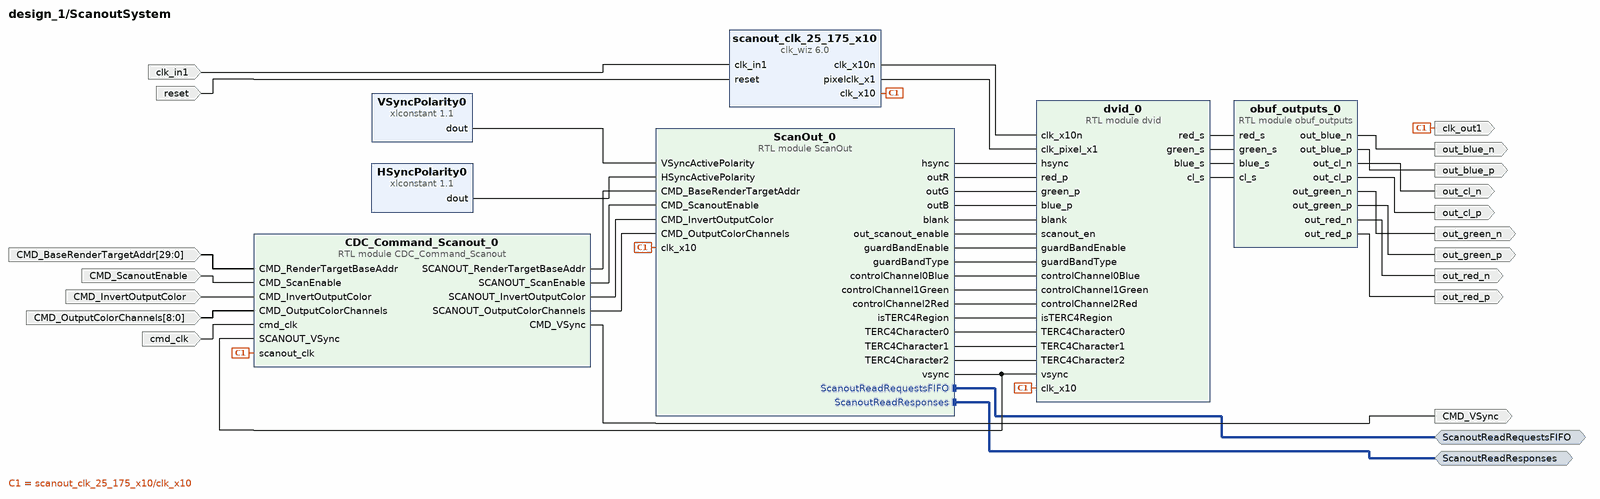
[diagram p6: block diagram inside /ScanoutSystem]
create_bd_intf_pin -mode Master -vlnv xilinx.com:interface:fifo_write_rtl:1.0 ScanoutReadRequestsFIFO
create_bd_intf_pin -mode Master -vlnv xilinx.com:interface:fifo_read_rtl:1.0 ScanoutReadResponses
create_bd_pin -dir I -from 29 -to 0 CMD_BaseRenderTargetAddr
create_bd_pin -dir I -type clk clk_in1
create_bd_pin -dir O -type clk clk_out1
create_bd_pin -dir I CMD_ScanoutEnable
create_bd_pin -dir I -type rst reset
create_bd_pin -dir O out_blue_p
create_bd_pin -dir O out_blue_n
create_bd_pin -dir O out_green_p
create_bd_pin -dir O out_green_n
create_bd_pin -dir O out_red_p
create_bd_pin -dir O out_red_n
create_bd_pin -dir O out_cl_p
create_bd_pin -dir O out_cl_n
create_bd_pin -dir I CMD_InvertOutputColor
create_bd_pin -dir I -from 8 -to 0 CMD_OutputColorChannels
create_bd_pin -dir O CMD_VSync
create_bd_pin -dir I -type clk cmd_clk

create_bd_cell -type ip -vlnv xilinx.com:ip:clk_wiz:6.0 scanout_clk_25_175_x10
set_property -dict [list \
  CONFIG.PRIM_IN_FREQ 250.0 \
  CONFIG.CLKIN1_JITTER_PS 40.0 \
  CONFIG.CLKOUT2_USED true \
  CONFIG.CLKOUT3_USED true \
  CONFIG.NUM_OUT_CLKS 3 \
  CONFIG.CLK_OUT1_PORT clk_x10 \
  CONFIG.CLK_OUT2_PORT pixelclk_x1 \
  CONFIG.CLK_OUT3_PORT clk_x10n \
  CONFIG.CLKOUT1_REQUESTED_OUT_FREQ 251.75 \
  CONFIG.CLKOUT2_REQUESTED_OUT_FREQ 25.175 \
  CONFIG.CLKOUT3_REQUESTED_OUT_FREQ 251.75 \
  CONFIG.CLKOUT3_REQUESTED_PHASE 180 \
  CONFIG.USE_LOCKED false \
  CONFIG.USE_RESET true \
  CONFIG.MMCM_DIVCLK_DIVIDE 25 \
  CONFIG.MMCM_CLKFBOUT_MULT_F 125.875 \
  CONFIG.MMCM_CLKIN1_PERIOD 4.000 \
  CONFIG.MMCM_CLKOUT0_DIVIDE_F 5.000 \
  CONFIG.MMCM_CLKOUT1_DIVIDE 50 \
  CONFIG.MMCM_CLKOUT2_DIVIDE 5 \
  CONFIG.MMCM_CLKOUT2_PHASE 180.000 \
  CONFIG.RESET_BOARD_INTERFACE reset \
  CONFIG.CLKOUT1_JITTER 169.784 \
  CONFIG.CLKOUT1_PHASE_ERROR 328.812 \
  CONFIG.CLKOUT2_JITTER 236.903 \
  CONFIG.CLKOUT2_PHASE_ERROR 328.812 \
  CONFIG.CLKOUT3_JITTER 169.784 \
  CONFIG.CLKOUT3_PHASE_ERROR 328.812 \
] [get_bd_cells scanout_clk_25_175_x10]
create_bd_cell -type module -reference obuf_outputs obuf_outputs_0
create_bd_cell -type module -reference CDC_Command_Scanout CDC_Command_Scanout_0
create_bd_cell -type module -reference ScanOut ScanOut_0
set_property -dict {CONFIG.Use_HDMI false} [get_bd_cells ScanOut_0]
create_bd_cell -type ip -vlnv xilinx.com:ip:xlconstant:1.1 VSyncPolarity0
set_property -dict {CONFIG.CONST_VAL 0} [get_bd_cells VSyncPolarity0]
create_bd_cell -type ip -vlnv xilinx.com:ip:xlconstant:1.1 HSyncPolarity0
set_property -dict {CONFIG.CONST_VAL 0} [get_bd_cells HSyncPolarity0]
create_bd_cell -type module -reference dvid dvid_0

# ---- hierarchy /ShaderCoreSystem ----
current_bd_instance /ShaderCoreSystem
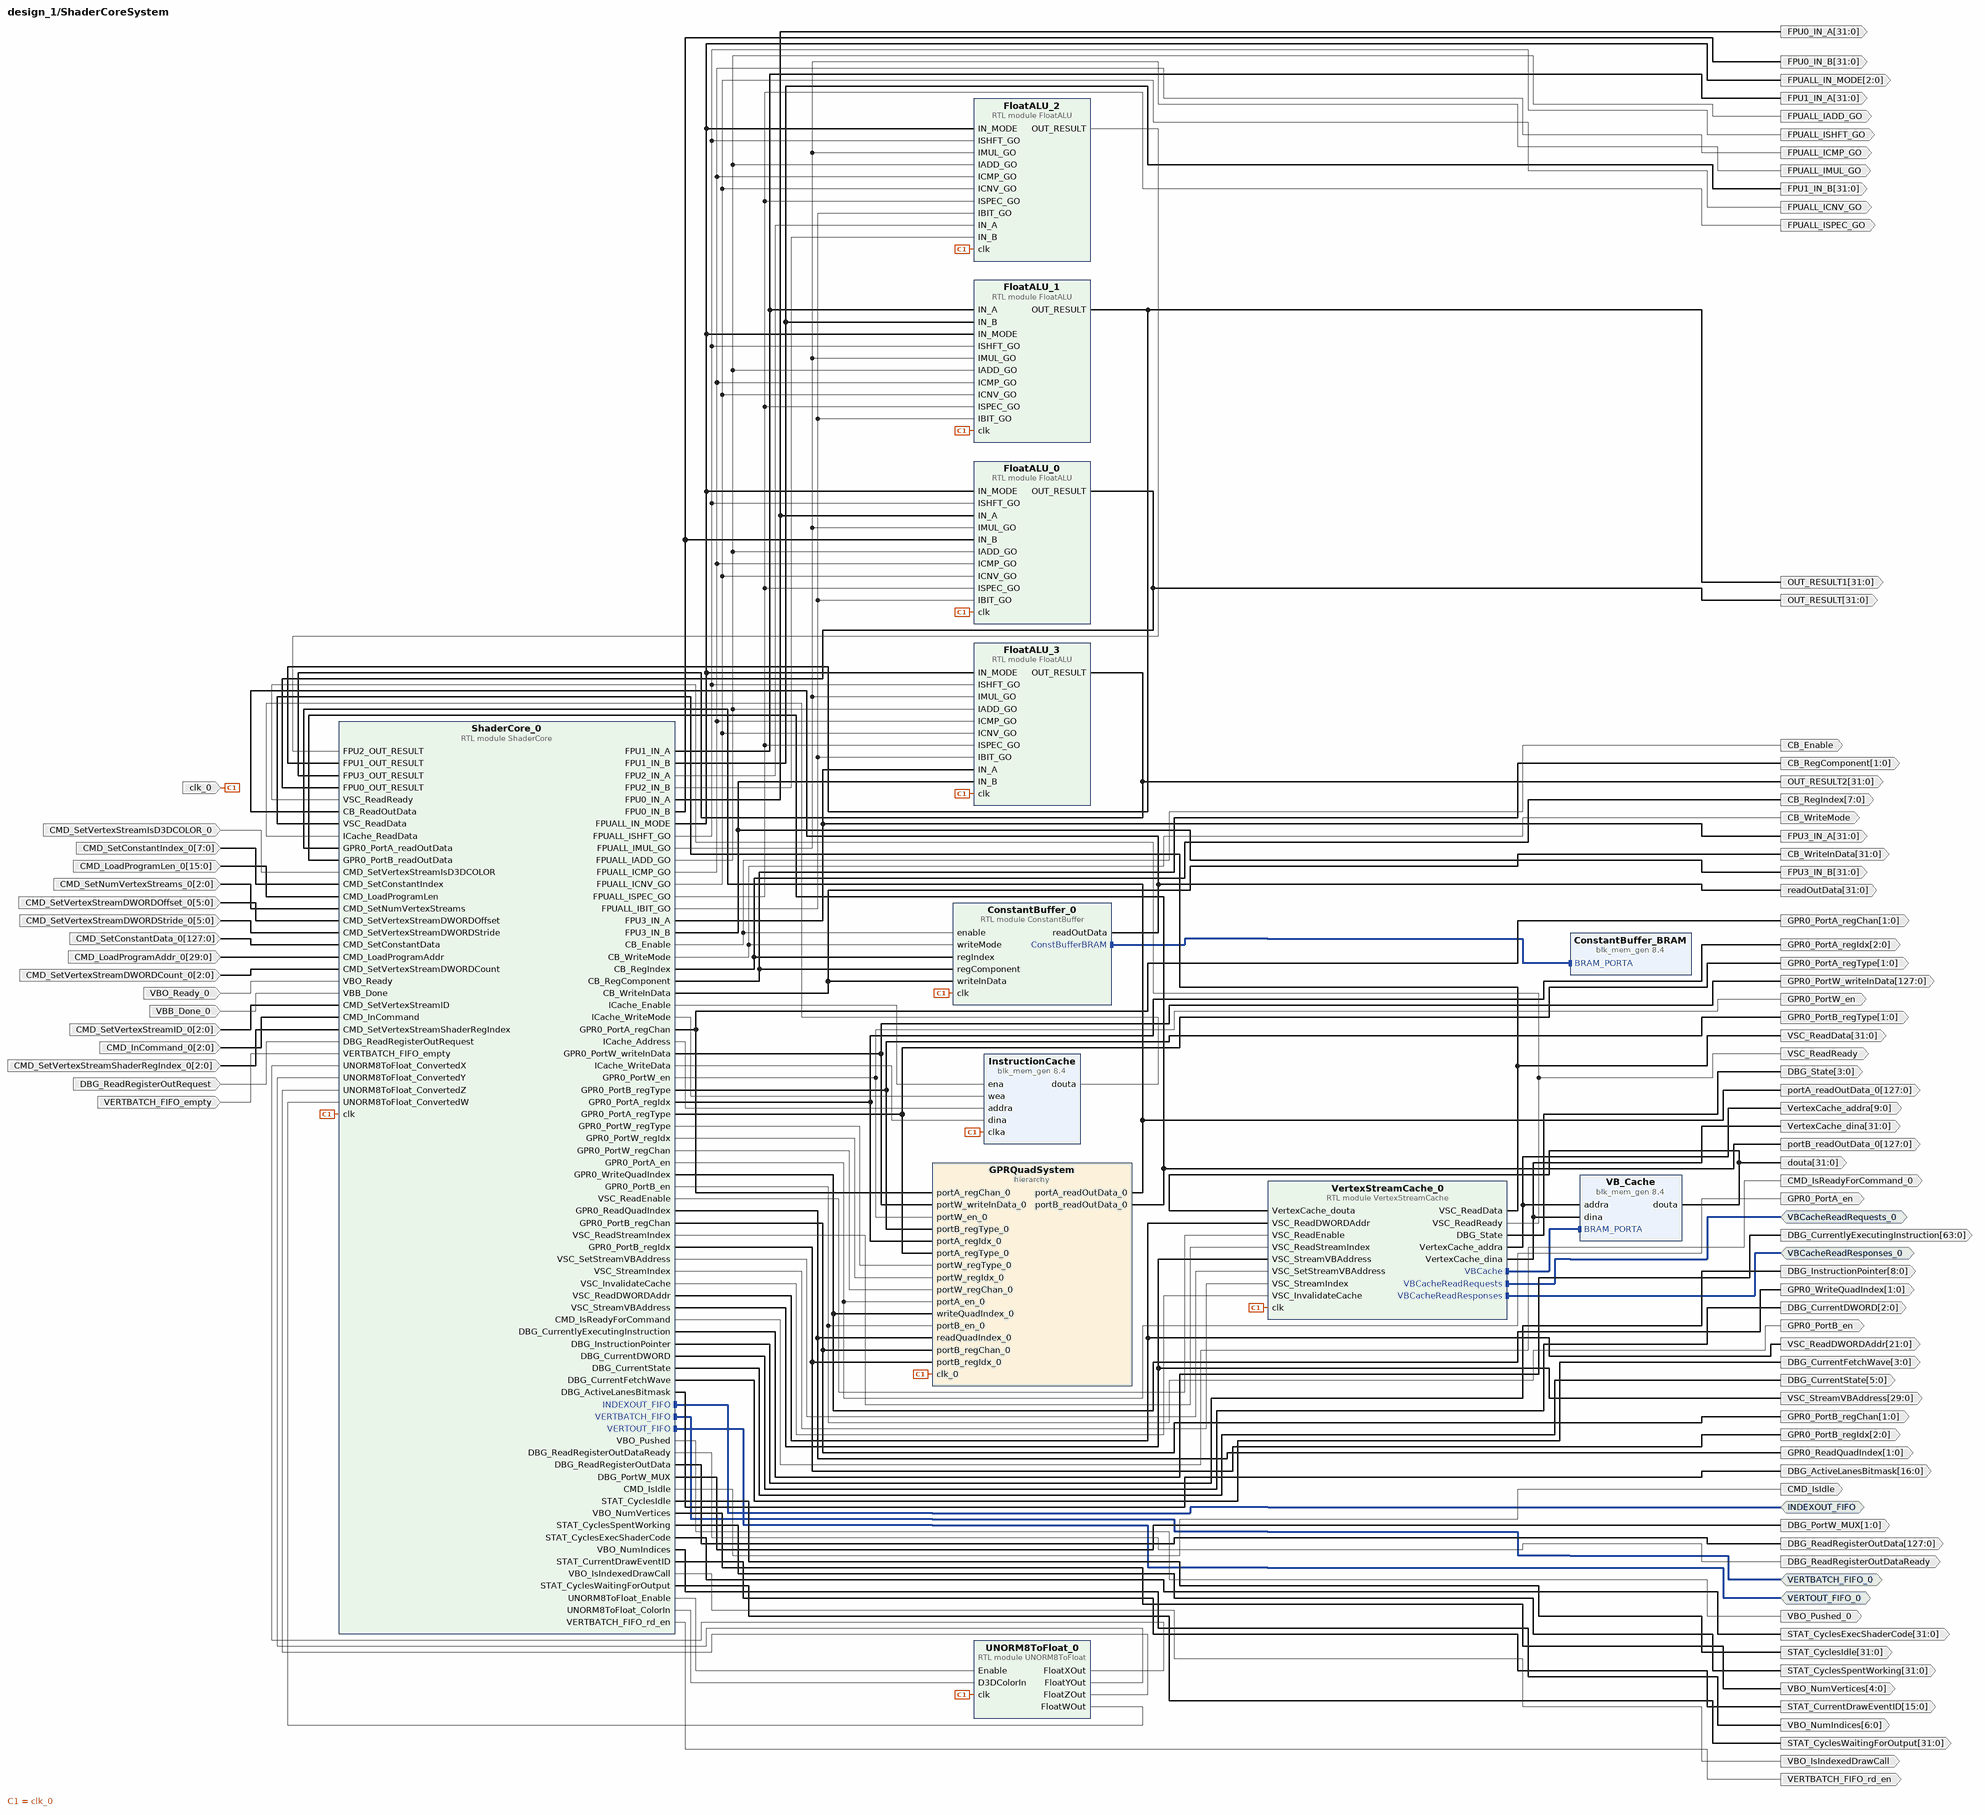
[diagram p7: block diagram inside /ShaderCoreSystem]
create_bd_intf_pin -mode Master -vlnv xilinx.com:interface:fifo_read_rtl:1.0 VERTBATCH_FIFO_0
create_bd_intf_pin -mode Master -vlnv xilinx.com:interface:fifo_write_rtl:1.0 VERTOUT_FIFO_0
create_bd_intf_pin -mode Master -vlnv xilinx.com:interface:fifo_write_rtl:1.0 VBCacheReadRequests_0
create_bd_intf_pin -mode Master -vlnv xilinx.com:interface:fifo_read_rtl:1.0 VBCacheReadResponses_0
create_bd_intf_pin -mode Master -vlnv xilinx.com:interface:fifo_write_rtl:1.0 INDEXOUT_FIFO
create_bd_pin -dir I -type clk clk_0
create_bd_pin -dir I CMD_SetVertexStreamIsD3DCOLOR_0
create_bd_pin -dir I -from 7 -to 0 CMD_SetConstantIndex_0
create_bd_pin -dir I -from 15 -to 0 CMD_LoadProgramLen_0
create_bd_pin -dir I -from 2 -to 0 CMD_SetNumVertexStreams_0
create_bd_pin -dir I -from 5 -to 0 CMD_SetVertexStreamDWORDOffset_0
create_bd_pin -dir I -from 5 -to 0 CMD_SetVertexStreamDWORDStride_0
create_bd_pin -dir I -from 127 -to 0 CMD_SetConstantData_0
create_bd_pin -dir O CMD_IsReadyForCommand_0
create_bd_pin -dir I -from 29 -to 0 CMD_LoadProgramAddr_0
create_bd_pin -dir I -from 2 -to 0 CMD_SetVertexStreamDWORDCount_0
create_bd_pin -dir I VBO_Ready_0
create_bd_pin -dir O VBO_Pushed_0
create_bd_pin -dir I VBB_Done_0
create_bd_pin -dir I -from 2 -to 0 CMD_SetVertexStreamID_0
create_bd_pin -dir I -from 2 -to 0 CMD_InCommand_0
create_bd_pin -dir I -from 2 -to 0 CMD_SetVertexStreamShaderRegIndex_0
create_bd_pin -dir O -from 8 -to 0 DBG_InstructionPointer
create_bd_pin -dir O -from 63 -to 0 DBG_CurrentlyExecutingInstruction
create_bd_pin -dir O -from 31 -to 0 VSC_ReadData
create_bd_pin -dir O -from 21 -to 0 VSC_ReadDWORDAddr
create_bd_pin -dir O -from 29 -to 0 VSC_StreamVBAddress
create_bd_pin -dir O VSC_ReadReady
create_bd_pin -dir O -from 3 -to 0 DBG_State
create_bd_pin -dir O -from 31 -to 0 VertexCache_dina
create_bd_pin -dir O -from 9 -to 0 VertexCache_addra
create_bd_pin -dir O -from 31 -to 0 douta
create_bd_pin -dir O -from 5 -to 0 DBG_CurrentState
create_bd_pin -dir O -from 2 -to 0 FPUALL_IN_MODE
create_bd_pin -dir O FPUALL_ISHFT_GO
create_bd_pin -dir O FPUALL_IMUL_GO
create_bd_pin -dir O FPUALL_IADD_GO
create_bd_pin -dir O FPUALL_ICMP_GO
create_bd_pin -dir O FPUALL_ICNV_GO
create_bd_pin -dir O FPUALL_ISPEC_GO
create_bd_pin -dir O -from 31 -to 0 FPU0_IN_A
create_bd_pin -dir O -from 31 -to 0 FPU0_IN_B
create_bd_pin -dir O -from 31 -to 0 OUT_RESULT
create_bd_pin -dir O CB_Enable
create_bd_pin -dir O -from 7 -to 0 CB_RegIndex
create_bd_pin -dir O -from 1 -to 0 CB_RegComponent
create_bd_pin -dir O -from 31 -to 0 readOutData
create_bd_pin -dir O -from 1 -to 0 GPR0_ReadQuadIndex
create_bd_pin -dir O -from 1 -to 0 GPR0_WriteQuadIndex
create_bd_pin -dir O GPR0_PortA_en
create_bd_pin -dir O GPR0_PortB_en
create_bd_pin -dir O GPR0_PortW_en
create_bd_pin -dir O -from 1 -to 0 GPR0_PortA_regType
create_bd_pin -dir O -from 2 -to 0 GPR0_PortA_regIdx
create_bd_pin -dir O -from 1 -to 0 GPR0_PortA_regChan
create_bd_pin -dir O -from 127 -to 0 portA_readOutData_0
create_bd_pin -dir O CB_WriteMode
create_bd_pin -dir O -from 31 -to 0 CB_WriteInData
create_bd_pin -dir O -from 3 -to 0 DBG_CurrentFetchWave
create_bd_pin -dir O -from 2 -to 0 DBG_CurrentDWORD
create_bd_pin -dir O -from 1 -to 0 GPR0_PortB_regType
create_bd_pin -dir O -from 2 -to 0 GPR0_PortB_regIdx
create_bd_pin -dir O -from 1 -to 0 GPR0_PortB_regChan
create_bd_pin -dir O DBG_ReadRegisterOutDataReady
create_bd_pin -dir O -from 127 -to 0 DBG_ReadRegisterOutData
create_bd_pin -dir I DBG_ReadRegisterOutRequest
create_bd_pin -dir O -from 31 -to 0 FPU1_IN_A
create_bd_pin -dir O -from 31 -to 0 FPU1_IN_B
create_bd_pin -dir O -from 31 -to 0 OUT_RESULT1
create_bd_pin -dir O -from 127 -to 0 portB_readOutData_0
create_bd_pin -dir O -from 127 -to 0 GPR0_PortW_writeInData
create_bd_pin -dir O -from 1 -to 0 DBG_PortW_MUX
create_bd_pin -dir O -from 4 -to 0 VBO_NumVertices
create_bd_pin -dir O -from 6 -to 0 VBO_NumIndices
create_bd_pin -dir O VBO_IsIndexedDrawCall
create_bd_pin -dir O -from 16 -to 0 DBG_ActiveLanesBitmask
create_bd_pin -dir O -from 31 -to 0 FPU3_IN_A
create_bd_pin -dir O -from 31 -to 0 FPU3_IN_B
create_bd_pin -dir O -from 31 -to 0 OUT_RESULT2
create_bd_pin -dir O -from 31 -to 0 STAT_CyclesIdle
create_bd_pin -dir O -from 31 -to 0 STAT_CyclesSpentWorking
create_bd_pin -dir O -from 31 -to 0 STAT_CyclesExecShaderCode
create_bd_pin -dir O -from 31 -to 0 STAT_CyclesWaitingForOutput
create_bd_pin -dir O -from 15 -to 0 STAT_CurrentDrawEventID
create_bd_pin -dir O CMD_IsIdle
create_bd_pin -dir O VERTBATCH_FIFO_rd_en
create_bd_pin -dir I VERTBATCH_FIFO_empty
